# EAGLE board tr02 (EAGLE 6.6.0), part 1 of 2
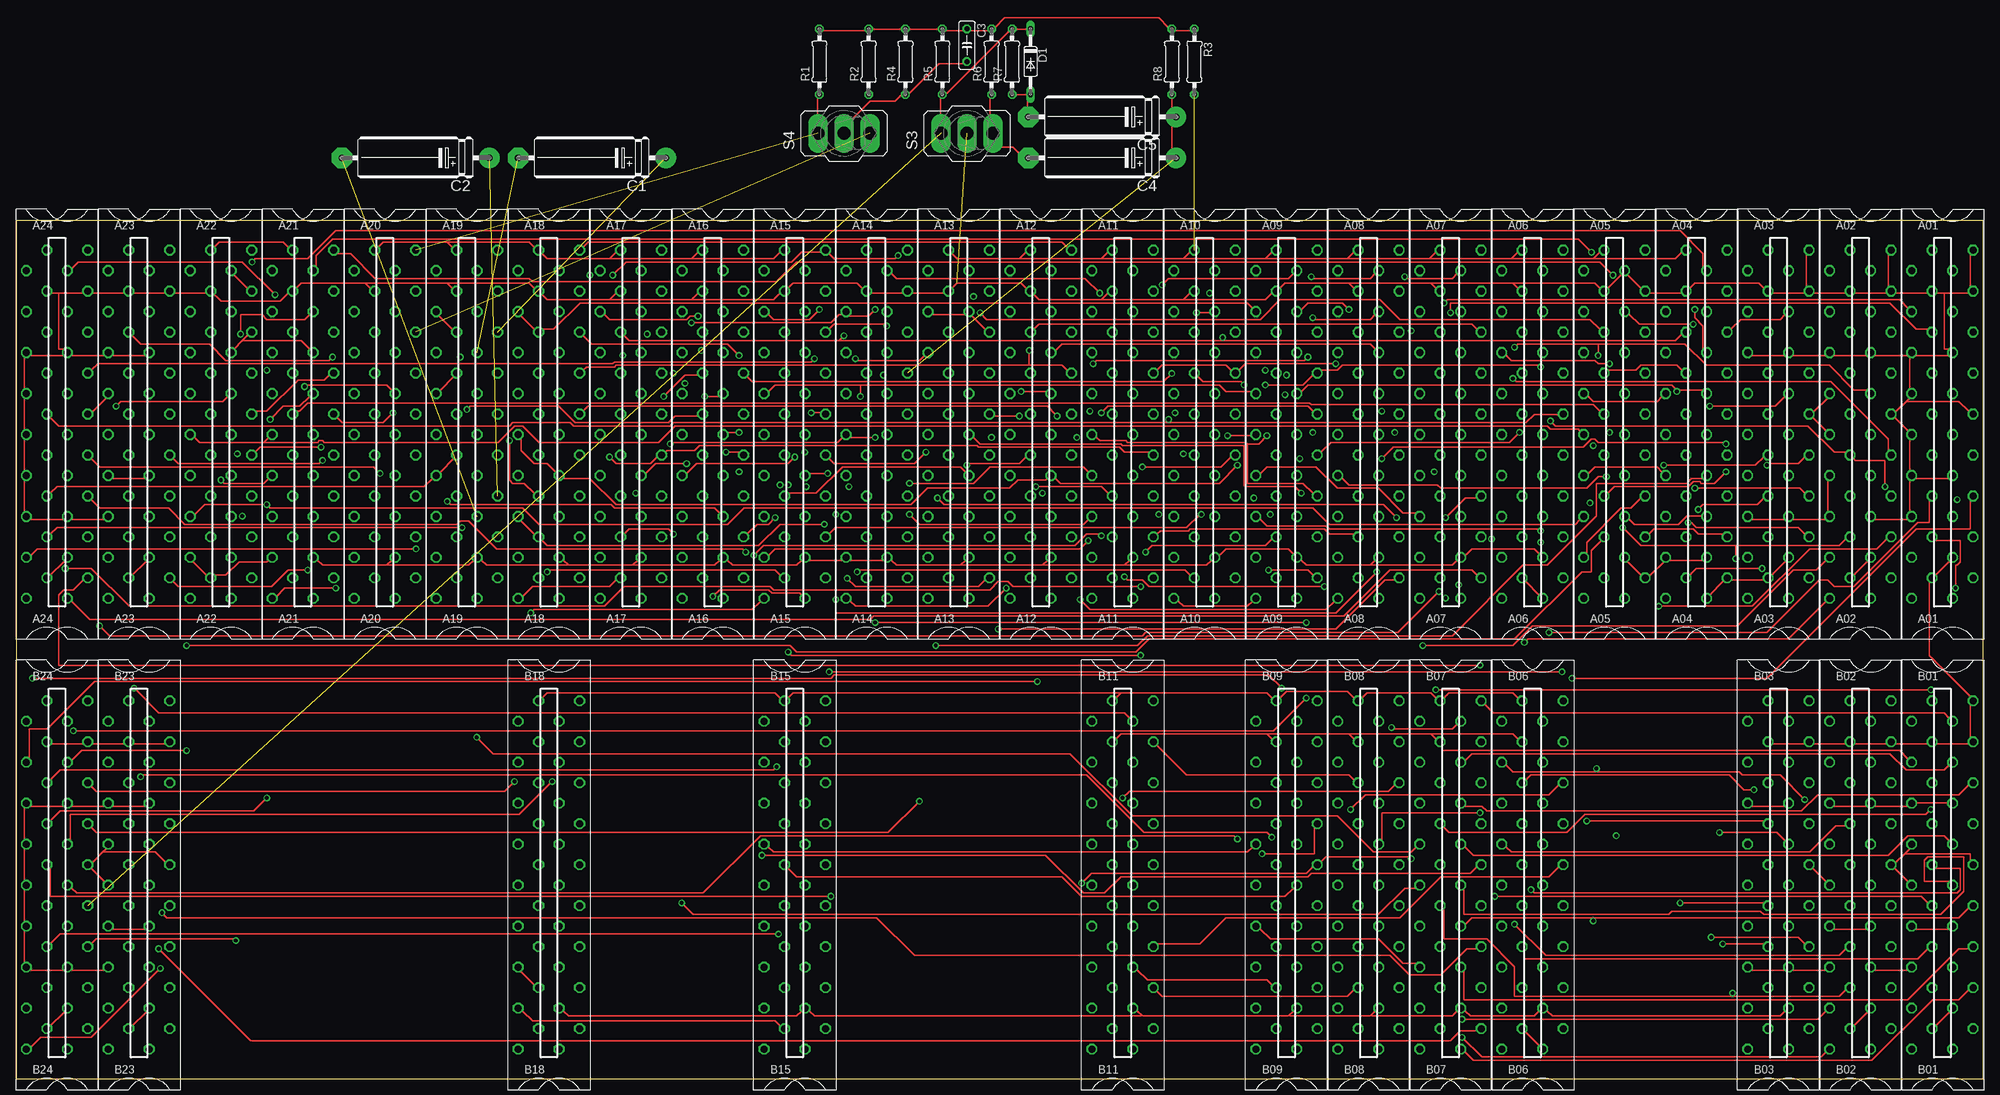
[diagram p10: board, top side]
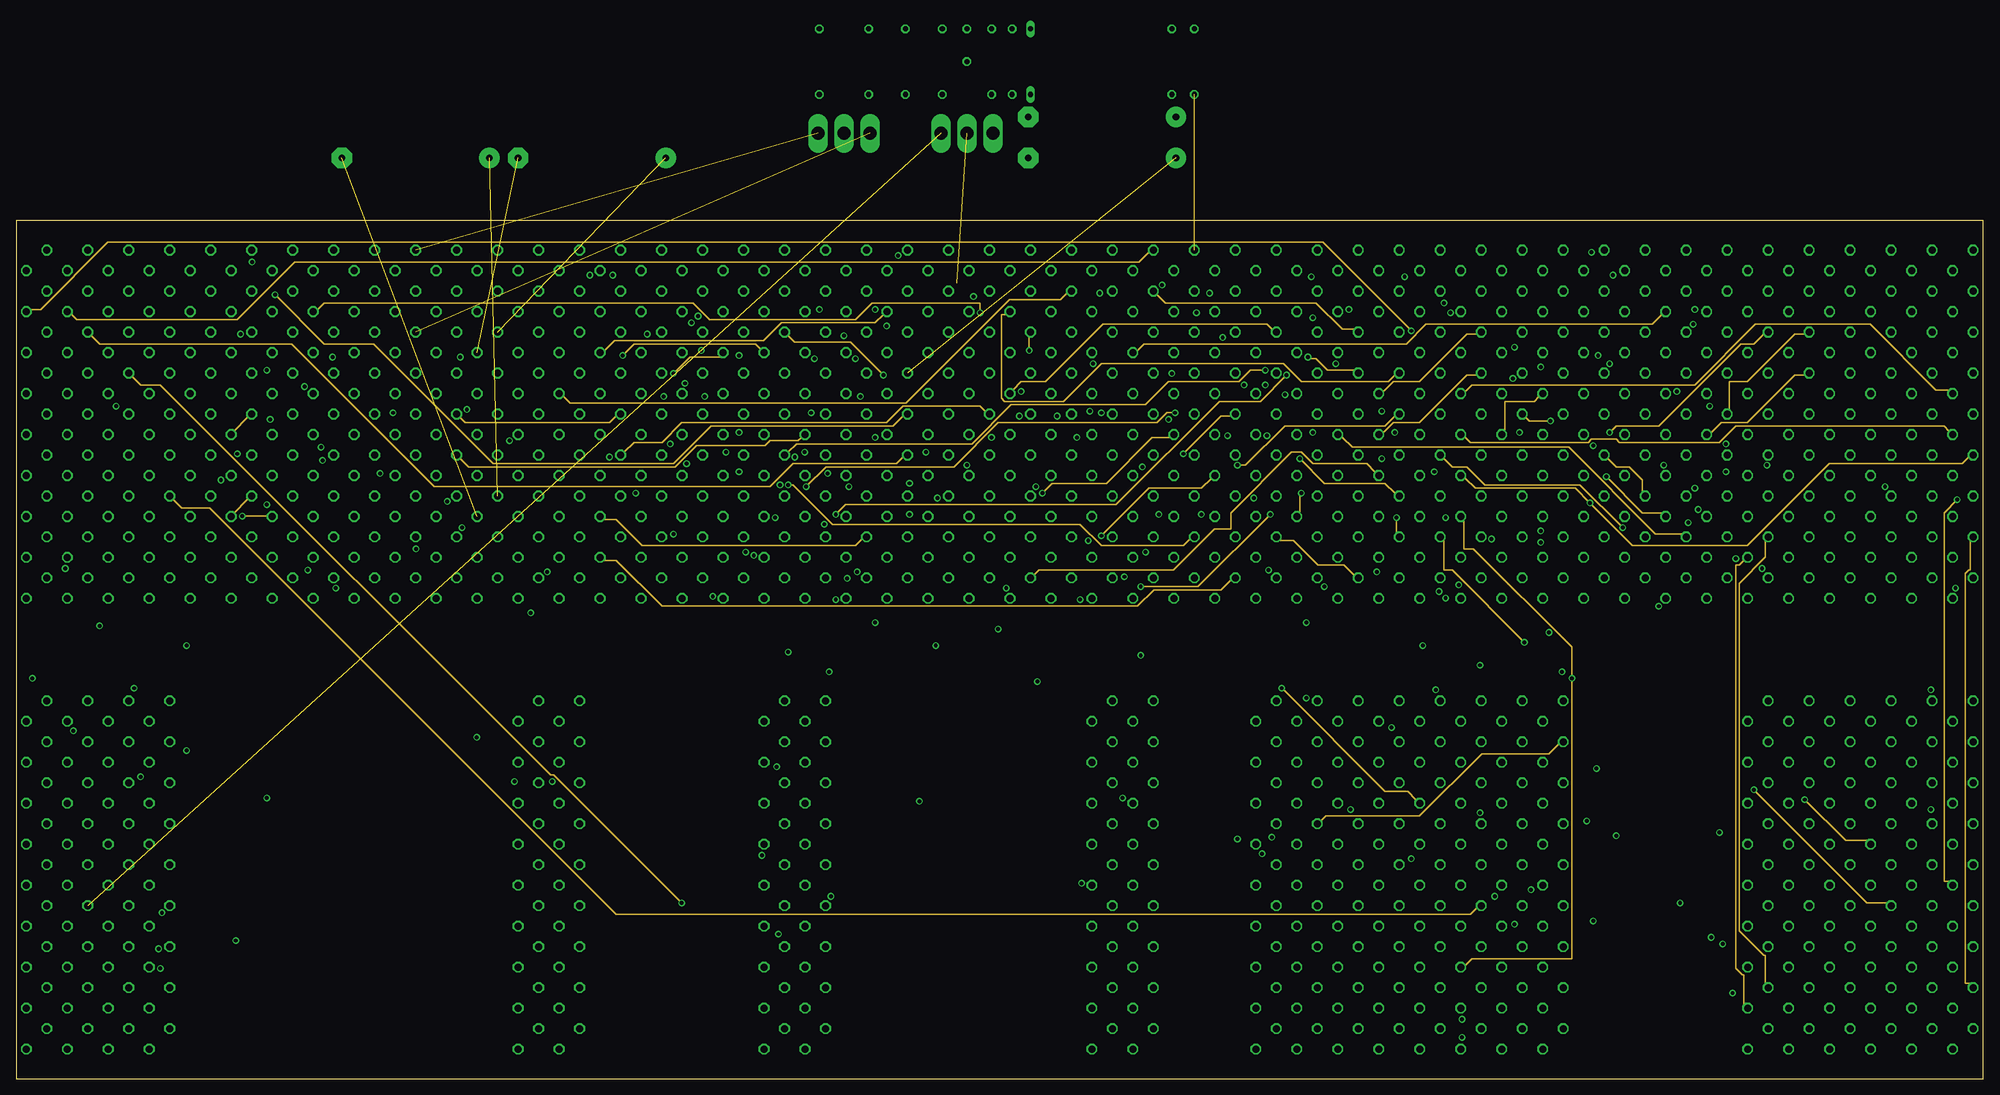
[diagram p11: board, inner layer Route2]
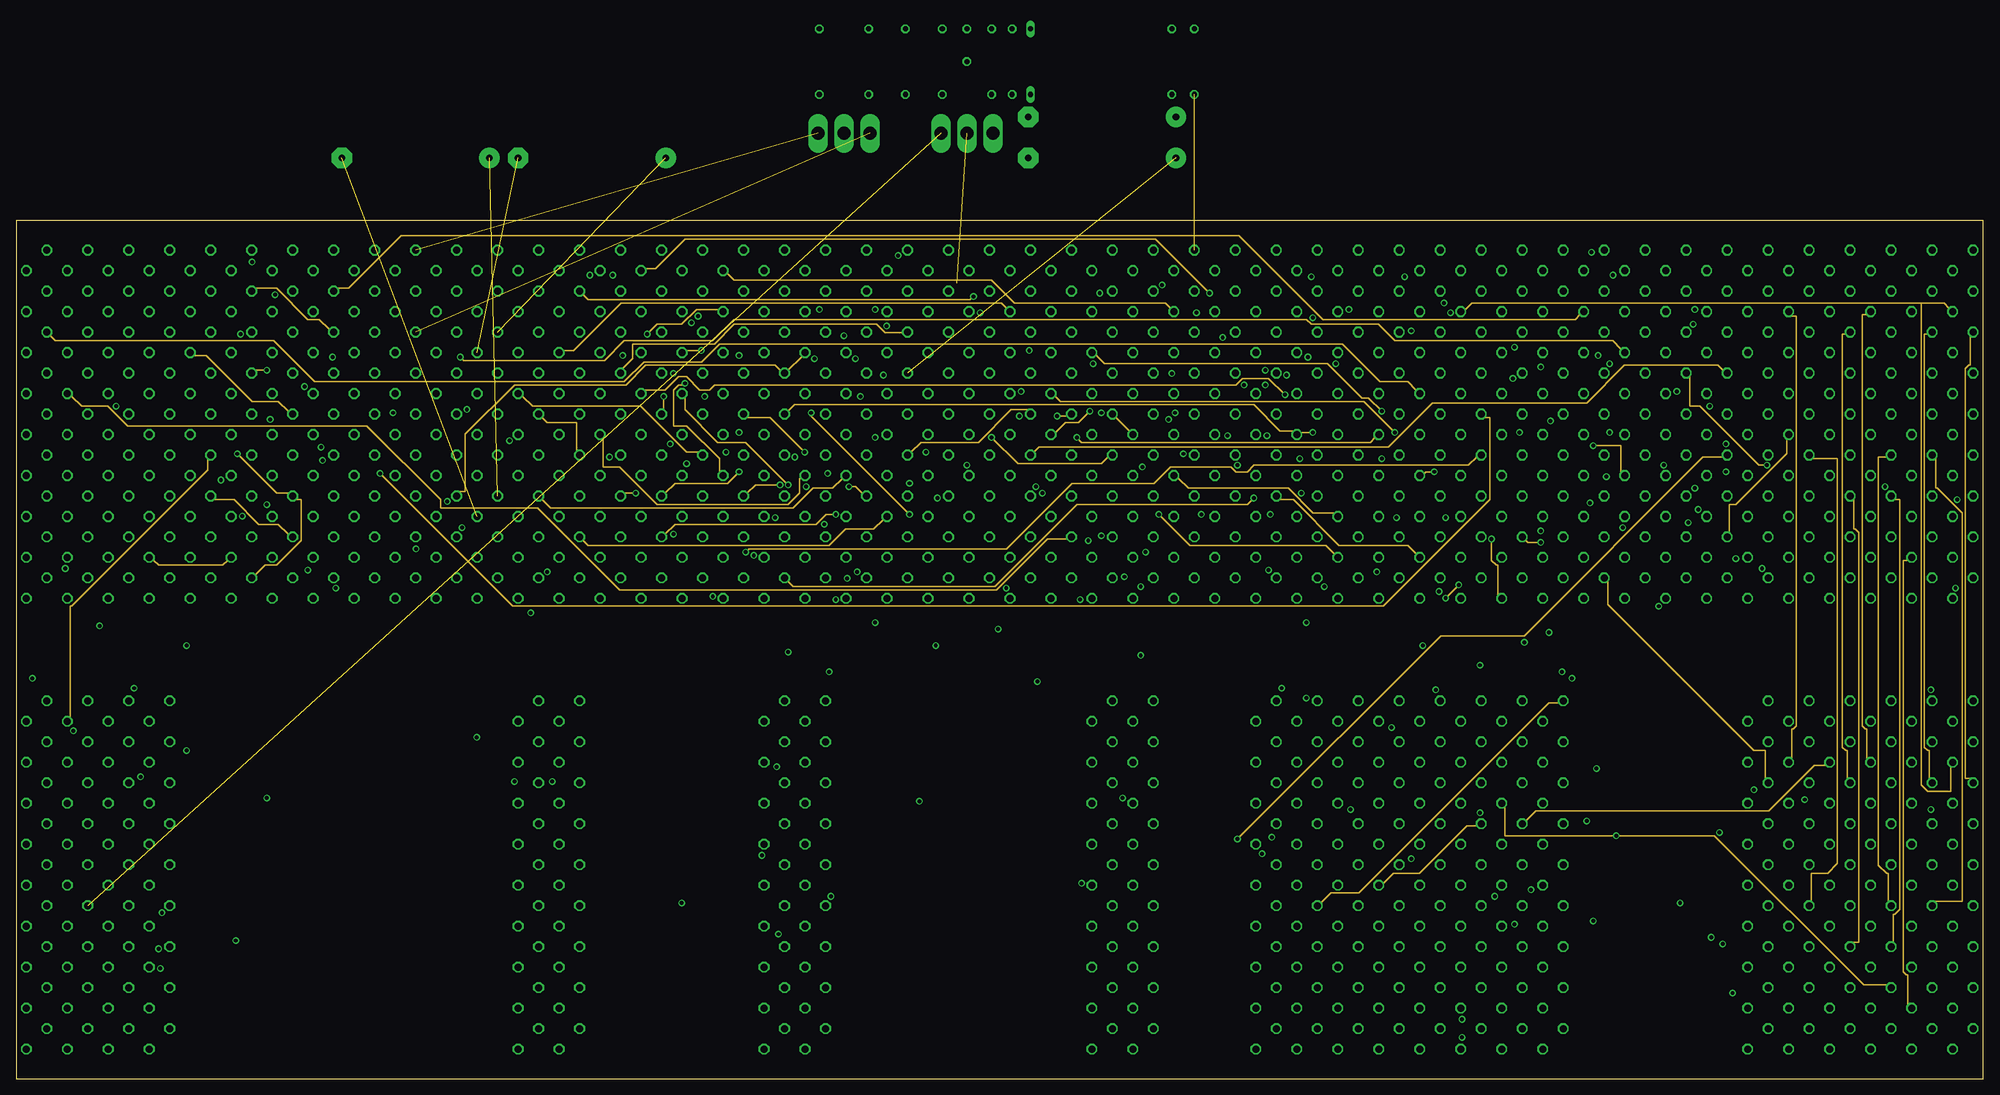
[diagram p12: board, inner layer Route15]
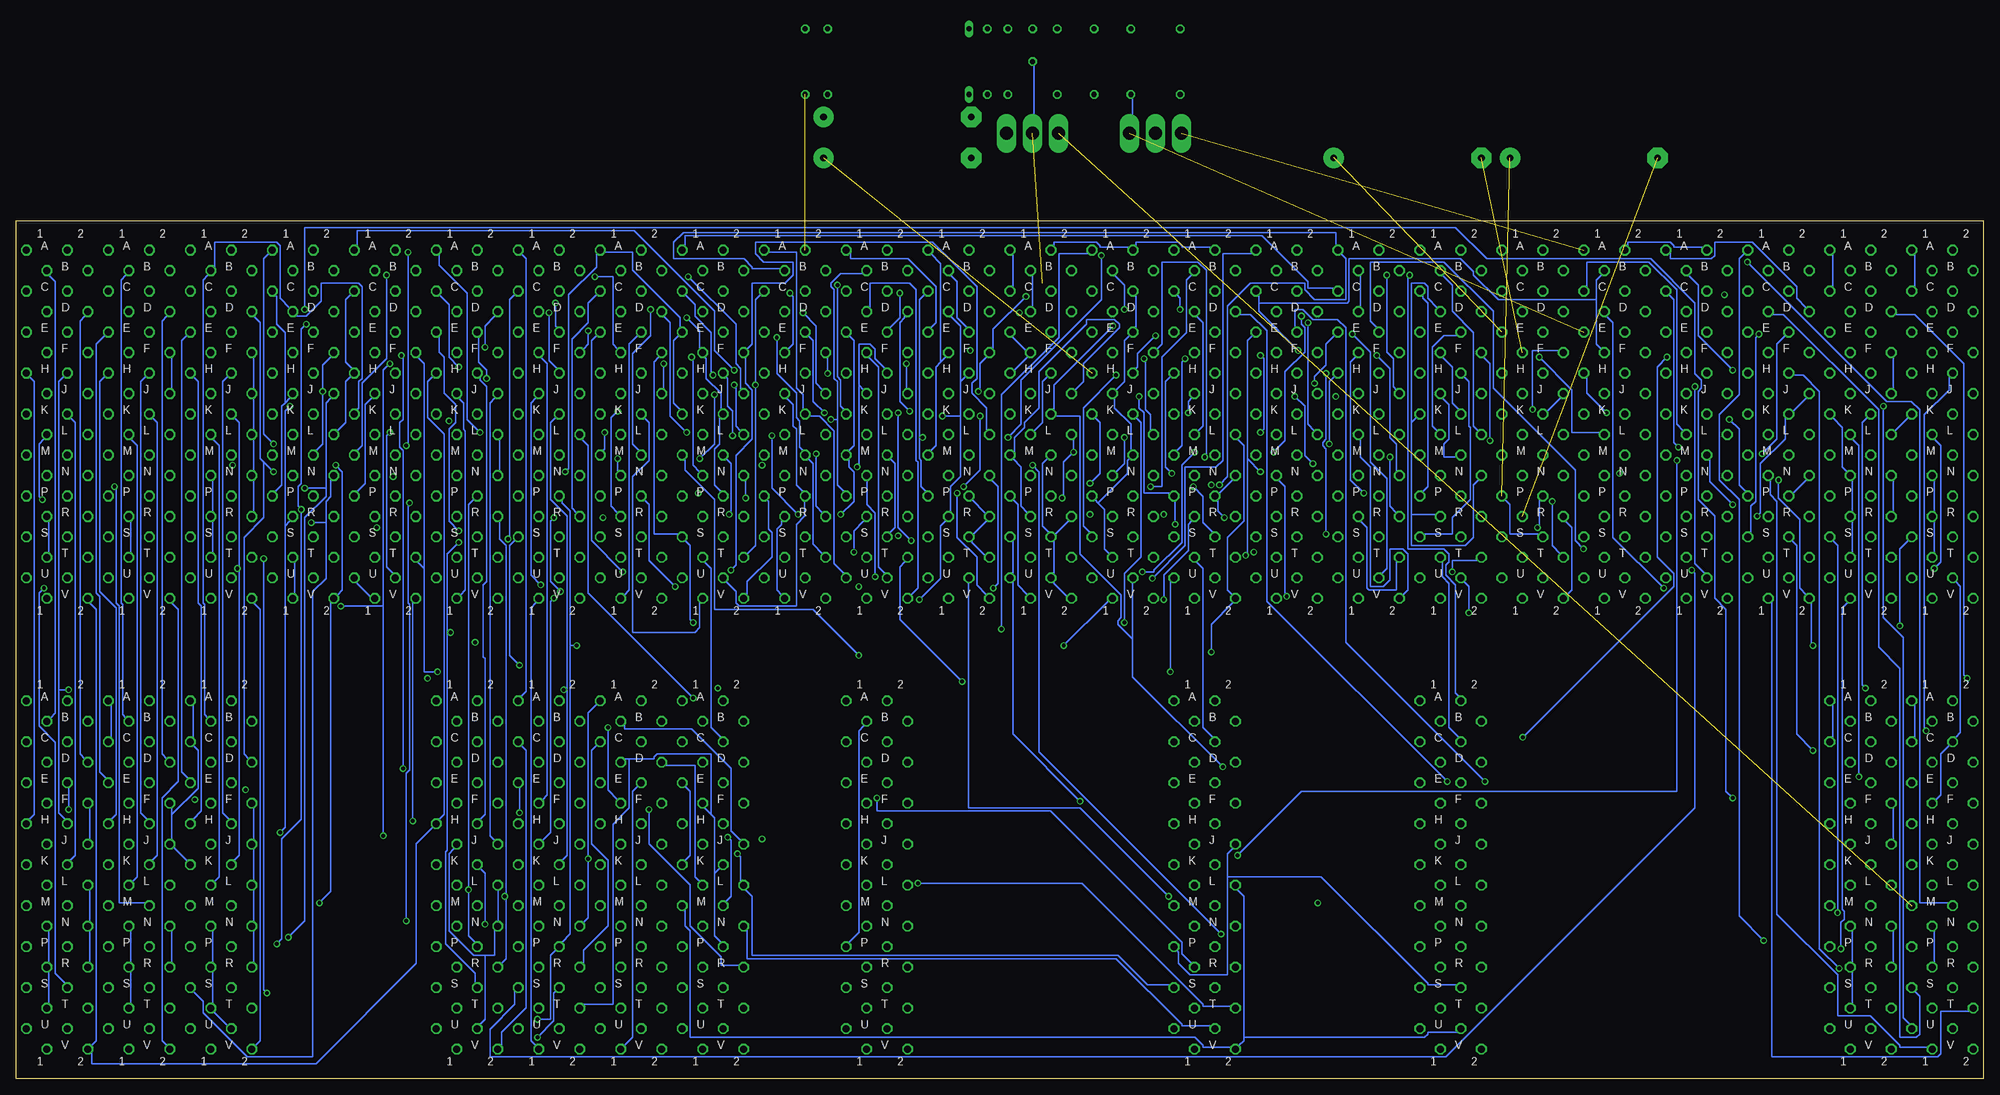
[diagram p13: board, bottom side, seen from below]

Size 304.78 x 133.02 mm. Coordinates in mm from the lower left corner, seen from the top.
Outline: 304.78,133.02 0,133.02 0,0 304.78,0 304.78,133.02
Copper layers (1*2*15*16): Top 0.035mm / dielectric 1.5mm / Route2 0.035mm / dielectric 0.15mm / Route15 0.035mm / dielectric 0.2mm / Bottom 0.035mm
Design rules "10mils": minimum track width 10mil, minimum drill 24mil, track to track 10mil, track to pad 10mil, pad to pad 10mil, via to via 10mil, smd to smd 10mil, copper to edge 25mil, drill to drill 10mil, minimum pad ring 10mil, minimum via ring 8mil, stop-mask expansion 0mil, vias tented up to drill 0mil, thermal gap 10mil
Net classes: 1 supply: width 0.203 mm

## Footprints (pad centres in the part's own frame; a part is rotated, then mirrored left to right if it is on the bottom)
H807 = drill 1.092 octagon: A1 4.763,28.575; A2 -1.587,28.575; B1 1.587,25.4; B2 -4.763,25.4; C1 4.763,22.225; C2 -1.587,22.225; D1 1.587,19.05; D2 -4.763,19.05; E1 4.763,15.875; E2 -1.587,15.875; F1 1.587,12.7; F2 -4.763,12.7; H1 4.763,9.525; H2 -1.587,9.525; J1 1.587,6.35; J2 -4.763,6.35; K1 4.763,3.175; K2 -1.587,3.175; L1 1.587,0; L2 -4.763,0; M1 4.763,-3.175; M2 -1.587,-3.175; N1 1.587,-6.35; N2 -4.763,-6.35; P1 4.763,-9.525; P2 -1.587,-9.525; R1 1.587,-12.7; R2 -4.763,-12.7; S1 4.763,-15.875; S2 -1.587,-15.875; T1 1.587,-19.05; T2 -4.763,-19.05; U1 4.763,-22.225; U2 -1.587,-22.225; V1 1.587,-25.4; V2 -4.763,-25.4
E22-6 = drill 1.016 pad 3.15: + -11.43,0 | drill 1.016 pad 3.15 octagon: - 11.43,0
C050-025X075 = drill 0.813 octagon: 1 -2.54,0; 2 2.54,0
DO35-10 = drill 0.813 long: A 5.08,0; C -5.08,0
0207/10 = drill 0.813 octagon: 1 -5.08,0; 2 5.08,0
320-916 = drill 2.007 long: 1 0,4.013; 2 0,0; 3 0,-4.013

## Placement (x,y rotation side)
A01  M903  [H807]  298.44,99.85 0 top
A02  M903  [H807]  285.74,99.85 0 top
A03  M903  [H807]  273.04,99.85 0 top
A04  M623  [H807]  260.34,99.85 0 top
A05  M623  [H807]  247.64,99.85 0 top
A06  M103  [H807]  234.94,99.85 0 top
A07  M101  [H807]  222.24,99.85 0 top
A08  M111  [H807]  209.54,99.85 0 top
A09  M115  [H807]  196.84,99.85 0 top
A10  M206X  [H807]  184.14,99.85 0 top
A11  M113  [H807]  171.44,99.85 0 top
A12  M117  [H807]  158.74,99.85 0 top
A13  M307  [H807]  146.04,99.85 0 top
A14  M206X  [H807]  133.34,99.85 0 top
A15  M115  [H807]  120.64,99.85 0 top
A16  M111  [H807]  107.94,99.85 0 top
A17  M113  [H807]  95.23,99.85 0 top
A18  M117  [H807]  82.53,99.85 0 top
A19  M302  [H807]  69.83,99.85 0 top
A20  M162  [H807]  57.13,99.85 0 top
A21  M162  [H807]  44.44,99.85 0 top
A22  M111  [H807]  31.73,99.85 0 top
A23  G784  [H807]  19.04,99.85 0 top
A24  G784  [H807]  6.33,99.85 0 top
B01  M903  [H807]  298.44,30 0 top
B02  M903  [H807]  285.74,30 0 top
B03  M903  [H807]  273.04,30 0 top
B06  M103  [H807]  234.94,30 0 top
B07  M101  [H807]  222.24,30 0 top
B08  M111  [H807]  209.54,30 0 top
B09  M115  [H807]  196.84,30 0 top
B11  M113  [H807]  171.44,30 0 top
B15  M115  [H807]  120.64,30 0 top
B18  M117  [H807]  82.53,30 0 top
B23  G784  [H807]  19.04,30 0 top
B24  G784  [H807]  6.33,30 0 top
C1  1uf  [E22-6]  89.2,142.71 180 top  (outside the outline)
C2  1uf  [E22-6]  61.9,142.71 180 top  (outside the outline)
C3  .01uf  [C050-025X075]  147.31,160.17 270 top  (outside the outline)
C4  1uf  [E22-6]  168.26,142.71 180 top  (outside the outline)
C5  1uf  [E22-6]  168.26,149.06 180 top  (outside the outline)
D1  D664  [DO35-10]  157.15,157.63 270 top  (outside the outline)
R1  10K  [0207/10]  124.44,157.63 90 top  (outside the outline)
R2  10K  [0207/10]  132.07,157.63 90 top  (outside the outline)
R3  330  [0207/10]  182.55,157.63 270 top  (outside the outline)
R4  750  [0207/10]  137.78,157.63 90 top  (outside the outline)
R5  10K  [0207/10]  143.5,157.63 90 top  (outside the outline)
R6  10K  [0207/10]  151.12,157.63 90 top  (outside the outline)
R7  10K  [0207/10]  154.29,157.63 90 top  (outside the outline)
R8  10K  [0207/10]  179.06,157.63 90 top  (outside the outline)
S3  [320-916]  147.31,146.52 90 top  (outside the outline)
S4  [320-916]  128.26,146.52 90 top  (outside the outline)

## Tracks (layer width: path | path; a pad name or v marks a point on that pad's centre or on a via)
0AC00H
  Route2 0.254: A08.H1 213.6,109.05 212.58,108.04 199.12,108.04 196.33,110.83 168.13,110.83 162.29,104.99 153.15,104.99 152.64,105.5 152.64,118.45 153.4,118.45 A12.D2
  Route15 0.254: A18.K2 82.28,101.69 86.85,101.69 86.85,97.37 A18.M1 | A12.D2 152.64,120.23 93.71,120.23 86.34,112.86 84.82,112.86 A18.F1
  Bottom 0.254: A18.F1 83.8,111.85 82.28,110.32 82.28,104.74 81.27,103.72 A18.K2
0AC00L  (via drill 0.61)
  Top 0.254: A18.A1 87.87,128.87 88.63,129.63 162.04,129.63 162.8,128.87 A12.A1 | A08.F1 209.79,113.88 162.04,113.88 161.02,112.86 A12.F1 | v215.12,124.29 215.38,124.04 222.49,124.04 223.25,124.8 A07.B1
  Bottom 0.254: 161.53,111.09 162.29,110.32 162.29,98.13 163.05,97.37 A12.M1 | 161.53,111.09 160.77,111.85 A12.F1 | v215.12,124.29 212.33,124.29 212.33,113.88 211.57,113.12 A08.F1 | 161.53,111.09 161.53,126.33 163.05,127.85 A12.A1
0AC01H  (via drill 0.61)
  Top 0.254: A18.L2 78.22,99.15 78.22,97.37 80.25,95.34 82.28,95.34 A18.N1 84.82,93.05 88.89,93.05 92.95,88.99 138.67,88.99 141.21,91.53 153.91,91.53 155.18,92.8 159.5,92.8 159.75,93.05 A12.N1 161.02,93.05 161.78,92.29 186.42,92.29 v189.22,95.08
  Route2 0.254: v189.22,95.08 190.49,95.08 196.58,101.18 212.08,101.18 213.6,102.7 A08.K1
  Bottom 0.254: A18.B1 83.8,124.55 82.28,123.02 82.28,118.96 78.98,115.66 78.98,101.18 78.22,100.42 A18.L2
0AC01L  (via drill 0.61)
  Top 0.254: 156.96,110.58 162.04,110.58 162.8,109.82 A12.H1 | 156.96,110.58 92.95,110.58 92.69,110.32 88.38,110.32 87.87,109.82 A18.H1 | 156.96,110.58 v156.96,112.86 | A07.E1 226.3,116.17 225.54,116.93 158.48,116.93 157.72,116.17 A12.E2
  Route2 0.254: A08.J1 211.82,106.52 213.35,108.04 217.41,108.04 224.78,115.4 226.3,115.4 A07.E1 | v156.96,112.86 156.96,115.15 A12.E2
  Bottom 0.254: A12.E2 157.47,116.42 158.99,117.94 158.99,123.53 160.01,124.55 A12.B1
0AC02H  (via drill 0.61)
  Top 0.254: v155.69,106.52 159.75,106.52 A12.J1
  Route15 0.254: v213.6,100.16 208.77,104.99 161.78,104.99 161.02,105.75 A12.J1 | A18.C1 88.63,120.74 147.81,120.74 v148.32,121.25
  Bottom 0.254: A18.P1 86.85,91.02 86.09,91.78 86.09,120.23 86.85,120.99 86.85,121.5 A18.C1 | v155.69,106.52 155.43,106.77 155.43,110.83 154.42,111.85 A12.F2 153.4,113.12 153.4,116.17 v148.32,121.25 | v213.6,100.16 213.6,97.62 213.85,97.37 A08.M1
0AC02L  (via drill 0.61)
  Route2 0.254: A08.L1 211.82,100.16 213.35,101.69 217.41,101.69 224.78,109.05 226.3,109.05 A07.H1 | A18.J1 84.82,105.75 85.84,104.74 137.91,104.74 153.91,120.74 161.78,120.74 162.8,121.75 A12.C1
  Route15 0.254: v164.32,99.4 165.09,98.64 209.79,98.64 210.55,99.4 A08.L1
  Bottom 0.254: A18.M2 81.52,96.35 83.55,96.35 83.55,98.39 82.79,99.15 82.79,104.48 83.8,105.5 A18.J1 | 164.83,99.4 164.83,120.74 A12.C1 | 164.83,99.4 164.83,96.1 164.58,95.85 164.58,91.78 163.82,91.02 A12.P1 | 164.83,99.4 v164.32,99.4
0B01B_L  (via drill 0.61)
  Top 0.254: v36.56,126.58 37.07,127.09 45.2,127.09 49.52,131.41 257.8,131.41 261.35,127.85 261.35,125.82 A04.B1
  Bottom 0.254: v36.56,126.58 14.97,104.99 11.16,104.99 9.89,103.72 9.89,27.27 5.32,27.27 B24.M2
0BOT_FF_H  (via drill 0.61)
  Top 0.254: v153.4,76.03 150.61,73.24 130.03,73.24 129.27,74 A14.V2
  Bottom 0.254: v153.4,76.03 152.64,76.8 152.64,91.78 153.66,92.8 A12.N2
0BOT_L  (via drill 0.61)
  Top 0.254: v117.84,48.35 117.33,47.84 6.84,47.84 5.32,46.32 B24.E2 | v134.86,116.67 134.61,116.93 126.73,116.93 125.97,116.17 A15.E1
  Bottom 0.254: v117.84,48.35 131.81,62.32 131.81,68.16 | 131.81,68.16 131.81,77.05 A14.U2 | 131.81,68.16 134.1,70.45 134.1,70.95 133.59,71.46 133.59,75.02 139.94,81.37 139.94,102.7 143.75,102.7 A13.K2 144,103.72 144,107.53 v134.86,116.67
0BOTFF_L  (via drill 0.61)
  Top 0.254: v142.48,67.14 173.72,67.14 175.25,68.67 222.49,68.67 233.41,79.59 237.22,79.59 244.84,87.21 244.84,92.29 258.81,92.29 259.57,93.05 261.35,93.05 A04.N1
  Bottom 0.254: v142.48,67.14 135.62,74 A14.V1
0DATA_BUSY_L  (via drill 0.61)
  Top 0.254: v83.04,46.06 77.96,40.98 8.37,40.98 8.37,36.92 B24.J1 | v124.44,119.21 122.92,117.69 117.33,117.69 116.57,118.45 A15.D2
  Bottom 0.254: v83.04,46.06 110.98,74 110.98,115.91 113.52,118.45 115.3,118.45 A15.D2 | v124.44,119.21 124.44,120.99 124.95,121.5 A15.C1
0DENSITY_SEL  (1 unrouted)
  Top 0.254: D1.C 156.7,162.65 154.93,162.65 R7.2 153.91,162.4 144.26,152.74 144,152.74 R5.1 143.24,151.98 143.24,149.44 S3.1
0DISABLE_MANCTL_L
  Route2 0.254: A24.E1 11.67,115.15 12.94,113.88 42.66,113.88 64.75,91.78 116.83,91.78 120.38,95.34 136.38,95.34 137.4,96.35 A14.M1
  Route15 0.254: A14.M1 138.67,97.12 140.19,98.64 149.08,98.64 154.16,103.72 156.7,103.72 A12.K2
0ENABLE_L  (1 unrouted)
  Top 0.254: R8.1 179.06,151.98 179.06,150.46 C5.+ 179.06,147.66 179.06,144.11 C4.+
0EOT_L  (via drill 0.61)
  Top 0.254: v158.23,61.56 12.18,61.56 4.81,54.19 2.02,54.19 2.02,49.62 B24.D2
  Bottom 0.254: v158.23,61.56 167.88,71.21 167.88,79.34 167.12,80.1 A11.T2
0EOTFF_L
  Route2 0.254: A04.D2 255,118.45 253.48,116.93 218.43,116.93 215.38,113.88 174.74,113.88 173.72,112.86 A11.F1
  Bottom 0.254: A11.U2 170.17,78.32 171.18,79.34 171.18,110.32 172.71,111.85 A11.F1
0FILE_PROT_L  (via drill 0.61)
  Top 0.254: v189.22,37.17 188.71,37.68 115.3,37.68 106.41,28.79 9.38,28.79 8.62,29.55 B24.L1
  Route15 0.254: v189.22,37.17 220.71,68.67 233.67,68.67 261.35,96.35 264.4,96.35 A04.M1
0FILEGAP_L
  Route15 0.254: A24.J1 8.62,105.75 10.14,104.23 14.21,104.23 17.26,101.18 54.34,101.18 65.77,89.75 65.77,88.48 80.76,88.48 93.46,75.78 151.88,75.78 159.75,83.65 162.8,83.65 A12.S1
0FWD_ENABLE  (via drill 0.61)
  Top 0.254: v92.44,124.55 94.47,126.58 120.13,126.58 121.65,128.11 124.7,128.11 A15.A1 125.97,127.85 126.73,127.09 136.13,127.09 v136.64,127.6
  Route15 0.254: v151.12,99.4 155.18,95.34 168.13,95.34 169.15,96.35 A11.M2
  Bottom 0.254: A11.S2 169.4,84.67 168.64,85.43 168.64,95.34 169.4,96.1 A11.M2 | v92.44,124.55 92.44,112.61 91.42,111.59 91.42,107.28 90.92,106.77 A17.J2 | v151.12,99.4 149.08,101.43 149.08,108.29 136.64,120.74 v136.64,127.6
0FWD_LD_L  (via drill 0.61)
  Top 0.254: v194.04,78.83 200.14,78.83 200.9,78.07 A09.U1
  Bottom 0.254: v194.04,78.83 193.28,79.59 193.28,96.61 190.74,99.15 190.74,106.77 191.76,107.78 191.76,111.85 A09.F2 191.5,113.12 190.74,113.88 190.74,123.28 185.66,123.28 184.39,124.55 184.39,126.58 188.96,126.58 190.23,127.85 190.23,129.63 162.8,129.63 155.94,122.77 155.94,108.55 156.7,107.78 156.7,106.26 154.42,103.97 154.42,100.42 A12.L2
0GAP_H  (via drill 0.61)
  Top 0.254: v101.33,98.39 101.58,98.64 127.24,98.64 128,99.4 A14.L2 129.27,99.4 v133.08,99.4 | v130.03,111.59 130.29,111.34 139.94,111.34 140.7,112.1 A13.F2
  Bottom 0.254: v101.33,98.39 101.33,108.04 100.57,108.8 A17.H1 | v133.08,99.4 133.08,95.34 134.35,94.07 A14.N1 | v130.03,111.59 129.78,111.34 129.78,103.72 129.02,102.96 129.02,100.42 A14.L2
0GAP_L  (via drill 0.61)
  Top 0.254: v199.12,90.77 198.11,91.78 190.49,91.78 190.23,92.04 190.23,98.13 171.44,98.13 171.18,98.39 149.34,98.39 148.32,99.4 A13.L1
  Route2 0.254: v199.12,90.77 198.87,90.77 198.87,87.72 A09.R1
  Bottom 0.254: A13.H2 145.02,108.8 145.78,108.04 145.78,101.69 147.05,100.42 A13.L1
0GAPSP_L  (via drill 0.61)
  Top 0.254: v104.63,117.18 126.22,117.18 127.49,118.45 128,118.45 A14.D2 129.02,118.2 132.07,118.2 v133.08,119.21 | v167.88,121.75 165.59,124.04 136.38,124.04 135.62,124.8 A14.B1
  Bottom 0.254: v104.63,117.18 104.63,101.43 103.62,100.42 A16.L2 | v133.08,119.21 133.08,123.02 134.61,124.55 A14.B1 | v167.88,121.75 167.88,117.94 169.4,116.42 A11.E2
0GIP_L  (via drill 0.61)
  Top 0.254: v118.09,22.44 6.84,22.44 5.32,20.92 B24.P2 | v147.31,95.08 147.56,95.34 155.43,95.34 156.45,96.35 A12.M2
  Route15 0.254: A04.H1 264.4,109.82 263.64,110.58 249.16,110.58 243.32,104.74 219.44,104.74 212.58,97.88 158.48,97.88 157.72,97.12 A12.M2
  Bottom 0.254: v118.09,22.44 146.29,50.63 146.29,94.07 v147.31,95.08
0INITA_L  (via drill 0.61)
  Top 0.254: v199.88,70.7 v133.08,70.7
  Bottom 0.254: A08.F2 205.22,111.85 205.98,111.09 205.98,84.42 202.17,84.42 A09.S1 201.15,83.4 200.39,82.64 200.39,71.21 v199.88,70.7 | v133.08,70.7 133.08,78.32 130.54,80.86 130.54,101.69 131.3,102.45 A14.K2
0INITB_L  (via drill 0.61)
  Top 0.254: v152.13,69.68 204.46,69.68 212.08,77.3 213.6,77.3 A08.U1
  Bottom 0.254: v152.13,69.68 152.13,106.01 143.24,114.9 143.24,127.85 138.67,127.85 A14.A1
0IOT01L  (via drill 0.61)
  Top 0.254: v107.94,74.77 108.95,75.78 116.57,75.78 117.08,75.27 121.4,75.27 121.65,75.02 A15.V1
  Route15 0.254: v103.62,107.78 103.36,107.53 102.6,107.53 101.84,106.77 101.84,101.18 103.87,101.18 108.95,96.1 108.95,94.07 A16.N1
  Bottom 0.254: v107.94,74.77 108.19,75.02 108.19,91.78 109.2,92.8 A16.N1 | v103.62,107.78 103.62,108.8 101.84,110.58 101.84,113.88 100.57,115.15 A17.E1
0IOT02L  (via drill 0.61)
  Top 0.254: 257.29,106.77 256.53,107.53 200.14,107.53 199.12,106.52 A09.J1 | 257.29,106.77 261.35,106.77 A04.J1 | 257.29,106.77 v257.29,106.52
  Bottom 0.254: A04.M2 258.3,97.37 257.29,98.39 v257.29,106.52 257.29,110.58 256.02,111.85 A04.F2 | 263.13,104.74 262.37,105.5 A04.J1 | 263.13,104.74 263.64,104.23 263.64,92.04 264.65,91.02 A04.P1 | 263.13,104.74 263.13,115.66 264.4,116.93 264.4,121.25 264.65,121.5 A04.C1
0IOT03_1L  (via drill 0.61)
  Top 0.254: v166.86,110.83 167.37,111.34 199.63,111.34 v200.14,111.85
  Route2 0.254: A08.H2 207.25,109.82 203.19,109.82 201.41,111.59 200.39,111.59 v200.14,111.85
  Bottom 0.254: v166.86,110.83 166.86,106.77 A11.J2 | v200.14,111.85 199.88,111.59 199.88,95.08 198.87,94.07 A09.N1
0IOT04L  (via drill 0.61)
  Top 0.254: v174.99,81.62 176.01,82.64 193.53,82.64 194.55,83.65 A09.S2
  Route2 0.254: A08.U2 207.25,78.07 205.73,79.59 201.66,79.59 197.85,83.4 195.82,83.4 A09.S2
  Bottom 0.254: v174.99,81.62 174.99,84.92 173.47,86.45 A11.R1
0IOT05_1L  (via drill 0.61)
  Top 0.254: A18.V2 78.47,74.77 80,76.29 91.93,76.29 92.95,77.3 A17.U2
  Route15 0.254: v97.78,115.4 99.3,116.93 103.11,116.93 105.39,119.21 108.95,119.21 A16.D1
  Bottom 0.254: v97.78,115.4 94.98,112.61 94.98,95.59 92.44,93.05 92.44,79.08 93.2,78.32 A17.U2
0IOT06_2L  (via drill 0.61)
  Top 0.254: v174.23,76.29 154.42,76.29 153.66,77.05 152.13,77.05 150.86,75.78 117.33,75.78 116.83,76.29 94.22,76.29 91.17,73.24 17.51,73.24 11.67,79.08 v7.61,79.08
  Route2 0.254: v194.3,87.46 183.12,76.29 v174.23,76.29
  Bottom 0.254: v194.3,87.46 194.04,87.72 194.04,95.34 194.8,96.1 A09.M2 | v7.61,79.08 6.59,80.1 6.59,98.13 7.61,99.15 A24.L1
0IOT07_1L  (via drill 0.61)
  Route2 0.254: v193.53,109.82 191.25,109.82 189.47,108.04 178.55,108.04 174.99,104.48 154.16,104.48 148.07,98.39 120.89,98.39 119.62,97.12 A15.M2
  Bottom 0.254: v193.53,109.82 196.58,112.86 196.58,118.96 209.03,131.41 251.95,131.41 251.95,129.12 A05.A1
0IOT07_2L  (via drill 0.61)
  Top 0.254: v239.51,63.08 v125.97,63.08 | A05.P1 251.7,90 250.18,88.48 248.65,88.48 243.32,83.15 243.32,81.37 A05.T2
  Route2 0.254: A05.M2 246.62,96.1 247.89,94.83 249.92,94.83 251.95,92.8 251.95,91.02 A05.P1
  Bottom 0.254: A05.J1 249.67,105.5 250.68,104.48 250.68,92.29 251.95,91.02 A05.P1 | v125.97,63.08 125.97,77.05 A15.U1 | v239.51,63.08 241.54,63.08 241.54,79.08 | 241.54,79.08 242.56,80.1 A05.T2 | 241.54,79.08 241.54,110.83 242.56,111.85 A05.F2
0IRG_H  (via drill 0.61)
  Route15 0.254: v211.57,103.47 209.54,105.5 208.52,105.5 203.19,110.83 168.64,110.83 167.37,112.1 A11.F2
  Bottom 0.254: v211.57,103.47 212.58,102.45 212.58,88.73 211.57,87.72 A08.R1
0IRG_L  (via drill 0.61)
  Top 0.254: v123.68,111.59 123.17,111.09 92.69,111.09 92.44,110.83 12.68,110.83 11.67,109.82 A24.H1 | v140.96,97.12 139.18,95.34 126.73,95.34 125.97,96.1 A15.M1 | v213.85,86.96 211.82,88.99 143.75,88.99 v142.73,90
  Route2 0.254: v213.85,86.96 213.85,84.67 A08.S1
  Bottom 0.254: v123.68,111.59 124.19,111.09 124.19,98.13 124.95,97.37 A15.M1 | A13.L2 140.96,99.15 v140.96,97.12 141.21,96.86 142.48,95.59 142.48,90.26 v142.73,90
0LD_FWD_L  (via drill 0.61)
  Top 0.254: v138.42,92.29 148.32,92.29 150.86,94.83 165.34,94.83 166.1,94.07 A11.N2 | v40.12,121.5 35.04,126.58 9.64,126.58 8.62,125.56 A24.B1
  Route2 0.254: v40.12,121.5 47.74,113.88 55.36,113.88 73.9,95.34 101.84,95.34 107.68,101.18 135.88,101.18 137.4,102.7 A14.K1
  Bottom 0.254: v138.42,92.29 136.89,93.81 136.89,101.69 137.65,102.45 A14.K1
0LPE_L  (via drill 0.61)
  Route15 0.254: v68.82,111.85 69.33,111.34 91.17,111.34 94.22,114.39 107.94,114.39 111.24,117.69 199.88,117.69 200.65,116.93 211.06,116.93 213.6,114.39 247.38,114.39 248.65,113.12 A05.F1
  Bottom 0.254: v68.82,111.85 63.74,106.77 63.74,100.16 59.42,100.16 A20.L1
0MB09H  (via drill 0.61)
  Top 0.254: A18.R2 78.22,86.45 80.25,84.42 A18.S2 82.28,82.64 115.05,82.64 118.35,85.94 v125.21,85.94 | 130.8,107.53 v130.8,105.75 | 130.8,107.53 117.59,107.53 116.57,106.52 A15.J2 | 130.8,107.53 186.42,107.53 187.44,106.52 191.5,106.52 A09.J2 | v200.65,124.29 200.9,124.04 209.79,124.04 210.55,124.8 A08.B1
  Bottom 0.254: v130.8,105.75 130.8,103.97 130.03,103.21 130.03,90.77 125.97,90.77 A15.P1 125.21,89.75 v125.21,85.94 | v200.65,124.29 193.28,116.93 193.28,110.83 192.52,110.07 192.52,106.77 A09.J2
0MB09L  (via drill 0.61)
  Top 0.254: v166.1,83.4 164.83,82.13 117.59,82.13 116.57,81.11 A15.T2 | v168.13,103.21 169.15,104.23 200.14,104.23 200.9,103.47 A09.K1
  Route15 0.254: v219.7,94.07 218.43,94.07 218.17,93.81 A07.N2
  Bottom 0.254: v166.1,83.4 168.13,85.43 v168.13,103.21 | A09.K1 201.92,103.72 202.93,104.74 202.93,114.39 A09.E1 201.92,116.42 201.92,117.94 209.28,125.31 209.28,128.11 213.6,128.11 A08.A1 214.87,127.85 214.87,125.82 219.19,121.5 219.19,94.58 v219.7,94.07
0MB10H  (via drill 0.61)
  Route15 0.254: v200.9,100.16 199.12,100.16 A09.L1 197.85,100.42 195.82,100.42 191.76,104.48 120.64,104.48 119.62,103.47 A15.K2
  Bottom 0.254: v200.9,100.16 203.44,102.7 203.44,117.18 204.46,118.2 A08.D2
0MB10L  (via drill 0.61)
  Top 0.254: v82.28,78.57 82.53,78.83 117.59,78.83 118.35,78.07 A15.U2 | A09.N2 192.77,93.81 193.79,94.83 201.41,94.83 204.71,91.53 211.06,91.53 214.87,87.72 216.9,87.72 A07.R2
  Route15 0.254: A15.U2 120.38,76.29 151.62,76.29 164.32,88.99 190.74,88.99 v191.76,90
  Bottom 0.254: v82.28,78.57 82.28,80.35 78.47,80.35 A18.T2 | A08.C1 216.14,120.23 216.14,117.18 218.68,114.64 218.68,88.48 217.92,87.72 A07.R2 | v191.76,90 191.76,92.8 A09.N2
0MB11H  (via drill 0.61)
  Top 0.254: v126.98,74.26 126.98,72.22 204.46,72.22 v210.81,78.57
  Bottom 0.254: v126.98,74.26 126.98,78.07 123.17,81.88 123.17,85.94 122.67,86.45 A15.R1 | v210.81,78.57 215.63,83.4 215.63,114.39 A08.E1
0MB11L  (via drill 0.61)
  Top 0.254: v200.9,117.94 201.15,117.69 209.79,117.69 210.55,118.45 A08.D1
  Route15 0.254: A07.T2 215.63,82.64 204.96,82.64 197.85,89.75 195.82,89.75 A09.P2
  Bottom 0.254: A09.P2 195.57,91.02 196.58,92.04 196.58,97.62 195.82,98.39 195.82,102.45 A09.K2 195.57,103.72 195.57,106.26 197.85,108.55 197.85,111.59 198.11,111.85 A09.F1 198.87,113.12 198.87,115.91 v200.9,117.94
0MYOP1  (via drill 0.61)
  Top 0.254: v79.74,72.22 80.25,72.73 114.03,72.73 115.3,74 A15.V2 | v232.9,100.16 231.38,98.64 203.69,98.64 202.17,97.12 A09.M1 | v119.62,66.13 120.13,65.62 v174.23,65.62
  Bottom 0.254: A15.L2 115.55,99.15 114.54,98.13 114.54,86.45 117.08,83.91 117.08,75.78 116.32,75.02 A15.V2 116.32,73.75 119.62,70.45 v119.62,66.13 | v79.74,72.22 79.74,76.29 80.5,77.05 A18.U2 | v232.9,100.16 234.94,102.2 234.94,121.75 239.25,126.07 239.25,127.85 A06.A1 | v174.23,65.62 181.34,72.73 196.58,72.73 196.58,89.75 201.15,94.32 201.15,96.1 A09.M1
0MYOP2  (via drill 0.61)
  Top 0.254: v183.63,87.46 183.37,87.46 181.34,85.43 126.98,85.43 125.97,84.42 A15.S1 | v187.69,99.66 191.5,99.66 A09.L2 | v193.53,107.53 199.38,107.53 200.9,109.05 A09.H1 202.17,109.82 204.71,109.82 205.47,110.58 235.95,110.58 v236.21,110.32
  Bottom 0.254: v183.63,87.46 187.69,91.53 v187.69,99.66 | v193.53,107.53 193.28,107.28 193.28,101.18 192.52,100.42 A09.L2 | v236.21,110.32 237.73,111.85 237.73,119.98 239.25,121.5 A06.C1
0MYOP4  (via drill 0.61)
  Top 0.254: v236.21,84.92 235.95,85.18 203.44,85.18 202.93,85.69 193.79,85.69 192.77,86.7 A09.R2
  Bottom 0.254: v236.21,84.92 237.73,86.45 237.73,100.67 236.71,101.69 236.71,104.48 238.49,106.26 238.49,111.85 239.25,112.61 239.25,115.15 A06.E1
0R_RESET_L  (via drill 0.61)
  Top 0.254: 178.04,101.69 101.84,101.69 101.33,101.18 86.34,101.18 85.84,101.69 76.95,101.69 76.44,101.18 6.59,101.18 5.32,102.45 A24.K2 | v178.55,102.2 178.04,101.69 | 178.04,101.69 233.92,101.69 235.19,102.96 239,102.96 A06.K1
  Bottom 0.254: 177.53,102.2 177.53,108.04 178.04,108.55 178.04,122.26 178.55,122.77 178.55,123.28 177.02,124.8 173.72,124.8 A11.B1 | 177.53,102.2 177.53,92.04 176.52,91.02 A11.P1 | 177.53,102.2 v178.55,102.2
0RD00H
  Top 0.254: A22.B1 33.77,124.55 35.8,122.52 A22.C1
  Route15 0.254: A21.E1 48.5,116.17 46.98,117.69 45.2,117.69 40.37,122.52 37.07,122.52 A22.C1
0RD00L  (via drill 0.61)
  Top 0.254: v247.38,124.55 245.35,126.58 120.89,126.58 117.84,123.53 80,123.53 79.49,124.04 55.61,124.04 51.8,127.85 49.77,127.85 A21.A1
  Bottom 0.254: v247.38,124.55 247.38,111.59 251.19,107.78 251.19,98.13 251.95,97.37 A05.M1 | A22.D2 27.42,119.47 28.94,120.99 28.94,122.77 35.8,129.63 41.64,129.63 41.64,127.6 42.15,127.09 48.5,127.09 48.5,128.11 A21.A1
0RD01H
  Top 0.254: 35.04,114.39 35.8,115.15 36.05,115.15 A22.E1 | 35.04,114.39 33.77,113.12 A22.F1 | A21.F1 44.18,114.39 35.04,114.39
0RD01L  (via drill 0.61)
  Top 0.254: v244.08,128.11 242.05,130.14 49.01,130.14 46.47,127.6 46.47,125.82 A21.B1
  Route15 0.254: v244.33,98.13 248.65,98.13 248.65,94.07 A05.N1 | v38.85,109.82 37.07,109.82 A22.H1
  Bottom 0.254: v244.33,98.13 244.08,98.39 v244.08,128.11 | v38.85,109.82 44.18,115.15 44.18,123.02 45.7,124.55 A21.B1
0RD02H
  Top 0.254: A21.H1 48.5,109.05 47.74,108.29 43.67,108.29 38.85,103.47 37.07,103.47 A22.K1
  Route2 0.254: A22.L1 33.77,100.42 35.8,102.45 36.05,102.45 A22.K1
0RD02L  (via drill 0.61)
  Top 0.254: v47.23,97.88 37.83,97.88 37.07,97.12 A22.M1
  Route15 0.254: A05.D2 242.3,118.45 241.54,117.69 202.42,117.69 189.47,130.65 59.67,130.65 51.55,122.52 49.77,122.52 A21.C1
  Bottom 0.254: v47.23,97.88 47.99,98.64 47.99,120.74 48.75,121.5 A21.C1
0RD03H  (via drill 0.61)
  Top 0.254: v39.35,102.2 41.39,104.23 43.93,104.23 45.45,105.75 A21.J1
  Route2 0.254: A22.R1 33.77,87.72 35.8,89.75 36.05,89.75 A22.P1
  Bottom 0.254: v39.35,102.2 37.83,100.67 37.83,92.04 36.81,91.02 A22.P1
0RD03L  (via drill 0.61)
  Top 0.254: v34.78,115.4 34.78,118.45 38.09,118.45 38.85,117.69 44.69,117.69 45.45,118.45 A21.D1 | v149.34,118.71 150.35,117.69 192.77,117.69 195.82,120.74 211.31,120.74 214.36,117.69 243.83,117.69 245.35,116.17 A05.E2
  Route2 0.254: v149.34,118.71 149.34,120.23 132.57,120.23 130.03,117.69 107.43,117.69 104.89,120.23 47.74,120.23 46.72,119.21 A21.D1
  Bottom 0.254: v34.78,115.4 35.29,114.9 35.29,89.5 36.05,88.73 36.05,84.67 A22.S1
0RD04H  (via drill 0.61)
  Route15 0.254: A22.U1 37.07,78.07 38.59,79.59 40.37,79.59 44.18,83.4 44.18,89.75 43.42,89.75 A21.P2 42.15,90.77 40.37,90.77 v34.27,96.86
  Bottom 0.254: A22.E2 31.99,113.88 31.99,99.15 v34.27,96.86
0RD04L
  Top 0.254: A05.K2 245.35,103.47 244.33,104.48 200.65,104.48 200.39,104.74 45.2,104.74 43.93,103.47 43.42,103.47 A21.K2
  Route15 0.254: A21.K2 42.15,103.47 40.62,104.99 36.56,104.99 29.45,112.1 27.67,112.1 A22.F2
0RD05H  (via drill 0.61)
  Route2 0.254: v35.04,87.21 39.1,87.21 A21.R2
  Bottom 0.254: v35.04,87.21 34.53,87.72 34.53,95.34 30.72,99.15 30.72,102.45 A22.K2 29.45,103.47 27.42,105.5 A22.J2
0RD05L
  Top 0.254: 38.34,98.64 28.43,98.64 27.67,99.4 A22.L2 | 38.34,98.64 39.1,99.4 A21.L2 | 38.34,98.64 46.72,98.64 46.98,98.89 47.48,98.89 47.74,98.64 74.66,98.64 77.2,101.18 78.47,101.18 81.01,98.64 99.55,98.64 102.09,101.18 237.22,101.18 237.73,100.67 242.05,100.67 242.3,100.42 A05.L2
0RD06H
  Route15 0.254: A21.S2 42.15,84.42 40.62,85.94 37.58,85.94 33.77,89.75 30.72,89.75 A22.P2
  Bottom 0.254: A22.N2 27.42,92.8 29.45,90.77 A22.P2
0RD06L  (via drill 0.61)
  Top 0.254: A22.R2 27.67,87.46 29.2,88.99 v38.85,88.99 39.1,88.73 39.35,88.48 78.47,88.48 81.01,85.94 110.22,85.94 112.76,88.48 200.9,88.48 203.44,85.94 241.54,85.94 242.3,86.7 A05.R2
  Bottom 0.254: v38.85,88.99 42.4,92.54 42.4,96.1 A21.M2
0RD07H
  Top 0.254: A22.T2 27.42,80.1 29.45,78.07 A22.U2 30.72,78.07 32.5,78.07 34.53,80.1 38.85,80.1 39.1,80.35 A21.T2
0RD07L  (via drill 0.61)
  Top 0.254: v31.73,92.8 32.24,92.29 38.34,92.29 39.1,93.05 A21.N2 | v26.4,67.14 119.87,67.14 120.89,66.13 173.47,66.13 175.5,68.16 232.14,68.16 242.56,78.57 244.08,78.57 244.08,81.88 245.6,83.4 A05.S2
  Bottom 0.254: v31.73,92.8 31.73,90 28.43,86.7 28.43,76.03 27.42,75.02 A22.V2 26.66,73.75 26.66,67.4 v26.4,67.14
0RD_DATA00L  (via drill 0.61)
  Top 0.254: v34.02,21.43 33.77,21.68 12.43,21.68 11.67,20.92 B24.P1
  Bottom 0.254: v34.02,21.43 37.83,25.23 37.83,89.75 40.88,92.8 40.88,102.96 37.83,106.01 37.83,127.09 A22.A1
0RD_DATA01L
  Bottom 0.254: B24.S1 10.65,13.55 9.89,12.79 9.89,6.95 10.4,6.44 12.94,6.44 12.94,63.59 16.24,66.89 16.24,103.72 30.97,118.45 32.75,118.45 A22.D1
0RD_DATA02L  (via drill 0.61)
  Top 0.254: v15.48,104.23 16.24,104.99 31.99,104.99 32.75,105.75 A22.J1
  Bottom 0.254: v15.48,104.23 15.48,71.46 12.43,68.41 12.43,9.49 11.41,8.47 B24.U1
0RD_DATA03L
  Bottom 0.254: B24.V1 8.62,4.92 12.94,4.92 12.94,5.17 17.51,9.74 22.59,9.74 22.59,16.09 31.99,25.49 31.99,89.5 33.01,90.51 33.01,92.8 A22.N1
0RD_DATA04L
  Bottom 0.254: B24.T2 2.27,10.5 6.59,10.5 6.59,3.9 7.1,3.39 32.75,3.39 32.75,74 A22.V1
0RD_DATA05L  (via drill 0.61)
  Top 0.254: v22.34,17.11 11.67,6.44 3.79,6.44 2.27,4.92 B24.V2
  Bottom 0.254: v22.34,17.11 25.38,20.16 25.38,106.52 27.93,109.05 29.45,109.05 A22.H2
0RD_DATA06L
  Route15 0.254: B24.B1 8.37,55.97 8.37,73.24 8.62,73.24 29.7,94.32 29.7,96.1 A22.M2
0RD_DATA07L  (via drill 0.61)
  Top 0.254: v26.4,50.89 10.14,50.89 8.62,49.37 B24.D1
  Bottom 0.254: v26.4,50.89 28.94,53.43 28.94,82.64 29.7,83.4 A22.S2
0RD_ENABLE_L  (via drill 0.61)
  Route2 0.254: v122.41,91.78 125.46,94.83 145.27,94.83 152.13,101.69 176.77,101.69 178.29,103.21 v179.56,103.21
  Bottom 0.254: v122.41,91.78 120.89,90.26 120.89,86.19 119.36,84.67 A15.S2 | v179.56,103.21 181.34,104.99 181.34,114.39 182.1,115.15 A10.E2
0RD_FWD_L  (via drill 0.61)
  Top 0.254: v76.44,98.89 76.44,92.8 76.95,92.29 78.72,92.29 80.25,90.77 A18.P2
  Route15 0.254: A14.N2 128,93.05 126.48,91.53 123.43,91.53 120.38,88.48 82.79,88.48 81.52,89.75 A18.P2
  Bottom 0.254: v76.44,98.89 76.44,110.83 77.45,111.85 A18.F2
0RD_LD_L
  Top 0.254: A18.D2 78.22,118.2 80.25,116.17 A18.E2 81.52,116.17 83.3,116.17 87.36,120.23 190.74,120.23 191.5,119.47 A09.D2
  Bottom 0.254: A18.L1 84.57,100.42 85.33,101.18 85.33,113.37 83.55,115.15 81.52,115.15 A18.E2
0RD_P_H  (via drill 0.61)
  Route15 0.254: v106.16,112.86 103.87,112.86 A16.F2
  Bottom 0.254: 59.93,120.74 59.93,123.79 59.17,124.55 A20.B1 | 59.93,120.74 59.93,113.88 59.17,113.12 A20.F1 | v106.16,112.86 112.25,118.96 112.25,120.23 | 112.25,120.23 112.25,121.5 A16.C1 | 59.93,120.74 75.17,120.74 78.98,124.55 78.98,125.06 81.01,127.09 98.28,127.09 98.28,120.48 98.54,120.23 112.25,120.23
0RD_PARITY_L  (via drill 0.61)
  Top 0.254: B24.E1 12.43,44.54 75.68,44.54 v77.2,46.06
  Bottom 0.254: v77.2,46.06 98.79,67.65 98.79,116.42 100.06,117.69 103.87,117.69 105.39,119.21 106.67,119.21 106.67,116.42 A16.E2
0RD_REV_L
  Route15 0.254: A14.R1 134.35,86.7 132.83,85.18 128.51,85.18 125.97,82.64 88.63,82.64 87.87,83.4 A18.S1
  Bottom 0.254: A18.S1 86.6,84.42 82.28,84.42 82.28,86.96 79.49,89.75 79.49,100.93 79.74,101.18 79.74,108.04 80.5,108.8 A18.H2
0READ_WRITE_H  (via drill 0.61)
  Top 0.254: v61.96,82.13 3.29,82.13 2.27,81.11 A24.T2 | 127.49,114.39 v128.26,115.15 | 127.49,114.39 94.98,114.39 94.22,115.15 A17.E2 | 186.93,114.39 127.49,114.39 | 186.93,114.39 257.03,114.39 258.05,115.4 A04.E2 | v186.93,114.9 186.93,114.39
  Bottom 0.254: A10.T2 179.82,81.37 181.34,82.89 181.34,95.34 182.1,96.1 A10.M2 182.87,97.37 183.37,97.88 183.37,101.94 183.88,102.45 183.88,106.26 186.93,109.31 v186.93,114.9 | v61.96,82.13 63.23,83.4 63.23,94.32 75.93,107.02 75.93,118.96 83.55,126.58 94.98,126.58 94.98,117.44 93.97,116.42 A17.E2 | v128.26,115.15 131.05,112.36 131.05,110.32 131.3,110.07 A14.H2
0RESET_L  (via drill 0.61)
  Top 0.254: v91.93,96.35 92.95,95.34 98.28,95.34 99.3,96.35 A17.M1 100.57,97.12 100.82,97.37 105.14,97.37 105.9,98.13 148.83,98.13 149.08,97.88 170.93,97.88 171.69,97.12 175.5,97.12 A11.M1
  Route2 0.254: A14.S2 131.05,83.65 130.03,82.64 97.01,82.64 92.95,86.7 91.17,86.7 A17.R2
  Route15 0.254: v177.02,87.46 181.85,82.64 202.93,82.64 204.2,81.37 A08.T2
  Bottom 0.254: v91.93,96.35 91.93,88.73 90.92,87.72 A17.R2 | v177.02,87.46 174.99,89.5 174.99,94.07 175.75,94.83 175.75,96.1 A11.M1 175.75,97.37 174.99,98.13 174.99,114.39 175.75,115.15 A11.E1
0REV_ENABLE  (via drill 0.61)
  Route2 0.254: v93.97,112.1 95.74,113.88 114.54,113.88 115.3,113.12 A15.F2
  Bottom 0.254: v93.97,112.1 91.93,110.07 91.93,99.4 90.92,98.39 90.92,94.07 A17.N2
0REWIND_L
  Route2 0.254: A24.D1 8.62,118.45 9.38,117.69 34.27,117.69 43.16,126.58 173.98,126.58 175.5,128.11 A11.A1
  Bottom 0.254: A12.E1 163.05,116.42 162.29,117.18 162.29,122.77 166.61,127.09 175.5,127.09 175.5,128.11 A11.A1
0RWND_DONE_L
  Bottom 0.254: A12.T2 154.67,81.11 156.7,83.15 156.7,83.4 A12.S2 156.45,84.42 154.42,86.45 A12.R2 154.67,87.46 154.67,87.72 156.7,89.75 A12.P2
0STROBE_H
  Route15 0.254: A10.D2 178.8,119.47 178.04,120.23 154.67,120.23 151.12,123.79 111.24,123.79 110.22,124.8 A16.B1
0STROBE_L  (via drill 0.61)
  Top 0.254: v139.94,43.02 135.11,38.19 12.43,38.19 11.67,38.95 B24.H1 | v128.76,77.56 130.03,76.29 149.08,76.29 150.1,77.3 A13.U1
  Bottom 0.254: v139.94,43.02 150.35,53.43 150.35,77.05 A13.U1 150.35,78.32 150.35,83.4 A13.S1 | v128.76,77.56 123.68,82.64 123.68,94.83 118.86,94.83 117.84,95.85 117.84,127.85 113.27,127.85 A16.A1
00SYNC_FWD_H  (via drill 0.61)
  Route15 0.254: v129.02,91.78 130.03,91.78 131.05,90.77 A14.P2
  Bottom 0.254: v129.02,91.78 127.24,91.78 127.24,111.85 123.43,115.66 123.43,123.79 122.67,124.55 A15.B1
0SYNC_FWD_L
  Top 0.254: A24.P2 5.32,90.77 6.33,91.78 63.23,91.78 64.5,93.05 A19.N2 65.52,94.07 65.77,94.07 67.8,96.1 A19.M2
  Route2 0.254: A15.L1 121.65,99.4 121.14,98.89 116.83,98.89 116.06,98.13 105.39,98.13 102.09,94.83 70.09,94.83 68.82,96.1 A19.M2
  Bottom 0.254: A15.L1 121.65,100.42 120.89,101.18 120.89,117.18 121.91,118.2 A15.D1
00SYNC_REV_H  (via drill 0.61)
  Route2 0.254: v134.35,109.05 129.27,114.13 120.64,114.13 119.62,115.15 A15.E2
  Bottom 0.254: v134.35,109.05 139.43,103.97 139.43,85.69 138.42,84.67 A14.S1
0SYNC_REV_L  (via drill 0.61)
  Top 0.254: v69.07,85.43 6.33,85.43 5.32,84.42 A24.S2
  Route15 0.254: A15.F1 121.91,111.85 121.65,111.85 119.62,109.82 A15.H2 118.35,109.82 117.59,110.58 97.52,110.58 94.47,107.53 77.2,107.53 69.58,99.91 69.58,91.02 68.56,91.02 A19.P2
  Bottom 0.254: v69.07,85.43 68.82,85.69 68.82,89.75 A19.P2
0TM_L  (via drill 0.61)
  Top 0.254: v38.85,43.52 36.81,41.49 6.84,41.49 5.32,39.97 B24.H2 | v260.08,119.21 260.08,117.94 261.35,116.67 261.35,113.12 A04.F1
  Bottom 0.254: v38.85,43.52 39.86,44.54 39.86,72.73 41.64,74.51 41.64,87.21 44.18,89.75 44.18,106.52 43.67,107.02 43.67,108.29 44.69,109.31 44.69,120.23 51.55,127.09 76.95,127.09 81.77,131.92 260.08,131.92 v260.08,119.21
0TR_READY_H  (via drill 0.61)
  Route2 0.254: v198.87,96.1 202.68,92.29 212.08,92.29 213.6,90.77 A08.P1
  Route15 0.254: v196.58,106.01 194.04,108.55 189.98,108.55 188.96,107.53 108.19,107.53 107.43,106.77 105.9,106.77 103.87,108.8 102.6,108.8 100.57,106.77 97.27,106.77 A17.J1
  Bottom 0.254: v198.87,96.1 196.58,98.39 v196.58,106.01
0TR_READY_L  (via drill 0.61)
  Top 0.254: v126.22,28.28 5.32,28.28 5.32,32.6 B24.K2 | v264.91,98.39 264.65,98.64 245.1,98.64 244.59,99.15 244.08,99.15 242.81,97.88 213.35,97.88 v211.57,96.1
  Route2 0.254: A08.N1 210.55,94.07 209.28,95.34 200.9,95.34 199.12,97.12 197.6,97.12 188.2,87.72 188.2,85.18 185.66,85.18 179.31,78.83 158.48,78.83 157.72,78.07 A12.U2
  Bottom 0.254: v126.22,28.28 139.94,42 157.21,42 157.21,77.05 A12.U2 | v264.91,98.39 266.43,99.91 266.43,127.09 265.67,127.85 A04.A1 | v211.57,96.1 211.57,94.07 A08.N1
0WDATA00L  (via drill 0.61)
  Top 0.254: v56.37,93.81 55.36,94.83 12.94,94.83 11.67,96.1 A24.M1
  Route15 0.254: v56.37,93.81 76.95,73.24 211.82,73.24 228.33,89.75 228.33,102.45 227.57,102.45 A07.K1
0WDATA01L  (via drill 0.61)
  Top 0.254: v113.02,81.62 112.51,82.13 74.41,82.13 70.09,86.45 68.82,86.45 68.31,85.94 26.15,85.94 23.61,88.48 12.94,88.48 11.67,89.75 A24.P1
  Route15 0.254: v113.02,81.62 113.52,82.13 153.4,82.13 163.56,92.29 176.26,92.29 178.8,94.83 188.2,94.83 188.96,94.07 190.74,94.07 191.76,95.08 225.03,95.08 226.3,96.35 A07.M1
0WDATA02L  (via drill 0.61)
  Top 0.254: v12.94,70.19 14.46,68.67 174.48,68.67 174.99,69.18 214.11,69.18 v220.46,75.53 | v221.47,86.96 224.52,90 226.3,90 A07.P1
  Bottom 0.254: v12.94,70.19 12.94,82.13 11.67,83.4 A24.S1 | v220.46,75.53 221.98,77.05 221.98,86.45 v221.47,86.96
0WDATA03L  (via drill 0.61)
  Top 0.254: v226.81,64.1 6.59,64.1 6.59,75.02 7.35,75.78 8.88,75.78 10.4,77.3 A24.U1
  Bottom 0.254: v226.81,64.1 228.33,65.62 228.33,82.64 227.57,83.4 A07.S1
0WDATA04L
  Top 0.254: A24.V1 8.62,74 11.41,71.21 132.32,71.21 132.83,71.72 205.73,71.72 212.84,78.83 225.54,78.83 226.3,78.07 A07.U1
0WDATA05L  (via drill 0.61)
  Route2 0.254: v216.14,115.91 202.42,129.63 14.21,129.63 3.79,119.21 2.27,119.21 A24.D2
  Bottom 0.254: v216.14,115.91 216.14,113.88 216.9,113.12 A07.F2
0WDATA06L
  Route15 0.254: A07.J2 216.9,106.77 215.63,108.04 211.31,108.04 205.47,113.88 108.95,113.88 106.16,111.09 97.27,111.09 94.22,108.04 46.21,108.04 39.86,114.39 6.08,114.39 5.32,115.15 A24.E2
0WDATA07L  (via drill 0.61)
  Top 0.254: v199.88,59.02 194.8,53.94 v8.88,53.94
  Bottom 0.254: v199.88,59.02 216.14,75.27 216.14,98.13 217.16,99.15 A07.L2 | v8.88,53.94 9.13,54.19 9.13,102.96 5.32,106.77 5.32,108.8 A24.H2
0WR_LD_L
  Route2 0.254: A12.J2 154.42,106.77 155.69,108.04 159.5,108.04 168.39,116.93 193.79,116.93 194.55,116.17 A09.E2
0WR_SET_H
  Route15 0.254: A17.H2 93.97,110.07 95.49,111.59 95.49,113.88 108.19,113.88 111.24,116.93 133.34,116.93 134.61,115.66 137.4,115.66 A14.E1
1AC00L  (via drill 0.61)
  Top 0.254: v213.09,54.45 213.35,54.19 222.49,54.19 223.25,54.95 B07.B1
  Bottom 0.254: v213.09,54.45 213.09,44.79 211.57,43.27 B08.F1
1AC01L  (via drill 0.61)
  Top 0.254: v226.81,41.24 211.57,41.24 211.57,36.92 B08.J1
  Bottom 0.254: v226.81,41.24 226.81,45.3 B07.E1
1AC02L
  Route15 0.254: B08.L1 211.82,30.32 213.35,31.84 217.41,31.84 224.78,39.2 226.3,39.2 B07.H1
1IOT04L
  Top 0.254: B11.R1 173.72,16.85 175.25,15.33 193.79,15.33 194.55,14.57 B09.S2
1IOT06_2L  (via drill 0.61)
  Top 0.254: v19.29,46.83 19.54,47.08 165.85,47.08 174.74,38.19 193.79,38.19 v194.55,37.43
  Bottom 0.254: v19.29,46.83 19.29,98.13 20.3,99.15 A23.L1 | v194.55,37.43 194.04,36.92 194.04,28.28 194.8,27.52 B09.M2
1MB09H
  Top 0.254: B18.R2 78.22,16.6 80.25,14.57 B18.S2 | B09.J2 191.5,35.9 190.74,35.14 117.33,35.14 116.57,35.9 B15.J2
  Bottom 0.254: B09.J2 192.52,36.92 194.04,38.44 194.04,48.09 200.14,54.19 210.55,54.19 210.55,54.95 B08.B1 | 117.08,31.33 117.08,34.89 116.32,35.65 B15.J2 | 117.08,31.33 117.08,16.09 122.92,16.09 124.7,17.87 124.7,19.65 124.95,19.9 B15.P1 | 117.08,31.33 102.6,31.33 86.09,14.82 86.09,14.57 81.52,14.57 B18.S2
1MB09L  (via drill 0.61)
  Top 0.254: v165.09,30.32 166.61,31.84 199.88,31.84 200.9,32.86 B09.K1 202.17,33.62 202.93,34.38 215.89,34.38 v216.14,34.12
  Bottom 0.254: B08.A1 216.14,56.73 v216.14,34.12 216.14,24.98 B07.N2 | v165.09,30.32 139.69,30.32 120.89,11.52 120.89,11.27 116.57,11.27 B15.T2 | B09.E1 201.15,45.3 200.39,44.54 200.39,34.63 201.15,33.87 B09.K1
1MB10H
  Top 0.254: B15.K2 119.62,32.6 120.89,31.33 162.04,31.33 165.09,28.28 196.58,28.28 197.85,29.55 B09.L1
  Bottom 0.254: B08.D2 204.2,48.6 199.63,48.6 199.63,31.33 198.87,30.57 B09.L1
1MB10L
  Top 0.254: B18.T2 78.47,10.5 80,8.98 117.59,8.98 118.35,8.22 B15.U2 | B09.N2 192.77,23.2 194.3,21.68 211.06,21.68 214.87,17.87 216.9,17.87 B07.R2
  Bottom 0.254: B08.C1 214.87,51.65 215.63,50.89 215.63,36.41 213.09,33.87 213.09,23.71 216.9,19.9 216.9,17.87 B07.R2 | B15.U2 119.62,8.22 124.19,8.22 124.19,8.47 134.35,18.63 191.5,18.63 191.5,23.2 B09.N2
1MB11H  (via drill 0.61)
  Top 0.254: v171.44,43.52 172.45,44.54 212.58,44.54 213.6,45.55 B08.E1
  Bottom 0.254: v171.44,43.52 171.44,41.49 144.51,41.49 124.19,21.17 124.19,19.39 122.67,17.87 B15.R1
1MB11L
  Bottom 0.254: 196.58,31.84 196.58,22.19 195.57,21.17 B09.P2 | 196.58,31.84 195.82,32.6 B09.K2 | 197.09,40.98 196.58,40.48 196.58,31.84 | 197.09,40.98 198.11,42 B09.F1 | 209.79,49.62 205.98,49.62 205.98,49.87 205.47,50.38 197.09,50.38 197.09,40.98 | 209.79,49.62 210.55,49.62 B08.D1 | 209.79,49.62 209.79,42 212.33,39.46 212.33,11.52 216.9,11.52 B07.T2
1MYOP1
  Route15 0.254: B09.M1 202.17,27.27 203.69,28.79 208.01,28.79 237.48,58.26 239,58.26 B06.A1
  Bottom 0.254: 114.54,6.44 114.54,28.28 115.55,29.3 B15.L2 | 114.54,6.44 114.54,5.93 115.3,5.17 B15.V2 116.57,4.92 120.89,4.92 120.89,5.17 122.16,6.44 200.39,6.44 200.39,22.95 201.15,23.71 201.15,26.25 B09.M1 | 114.54,6.44 86.6,6.44 86.09,6.95 86.09,7.2 81.52,7.2 B18.U2
1MYOP2  (via drill 0.61)
  Top 0.254: v193.03,34.89 201.15,34.89 201.15,38.95 B09.H1
  Route2 0.254: B06.C1 239,51.91 237.48,50.38 227.06,50.38 217.41,40.73 202.93,40.73 202.17,39.97 B09.H1
  Bottom 0.254: B15.S1 125.97,14.57 129.53,14.57 134.1,19.14 190.74,19.14 190.74,28.28 191.76,29.3 B09.L2 192.52,30.57 192.52,34.38 v193.03,34.89
1MYOP4  (via drill 0.61)
  Top 0.254: v206.74,41.74 209.03,44.03 237.48,44.03 239,45.55 B06.E1
  Bottom 0.254: v206.74,41.74 206.74,36.41 200.39,30.06 200.39,23.71 195.57,18.89 195.57,17.62 192.77,17.62 B09.R2
1R_RESET_L  (via drill 0.61)
  Top 0.254: B06.K1 239,32.86 237.48,31.33 220.71,31.33 214.36,24.98 187.44,24.98 183.37,20.92 176.77,20.92 B11.P1 | v18.27,60.54 22.08,56.73 171.69,56.73 172.45,55.97 B11.B1
  Bottom 0.254: B11.P1 175.75,21.17 174.23,22.7 174.23,53.94 173.47,54.7 B11.B1 | v18.27,60.54 18.78,61.05 18.78,101.69 18.02,102.45 A23.K2
1WDATA00L  (via drill 0.61)
  Top 0.254: v115.55,34.63 159.5,34.63 165.34,28.79 168.64,28.79 171.18,31.33 200.14,31.33 200.65,31.84 225.28,31.84 226.3,32.86 B07.K1 | v47.48,95.85 46.98,95.34 25.13,95.34 24.37,96.1 A23.M1
  Bottom 0.254: v115.55,34.63 105.65,44.54 47.48,44.54 v47.48,95.85
1WDATA01L
  Route2 0.254: A23.P1 24.37,89.75 25.64,88.48 29.96,88.48 92.95,25.49 225.28,25.49 226.3,26.51 B07.M1
1WDATA02L  (via drill 0.61)
  Top 0.254: v22.59,25.74 23.35,24.98 133.34,24.98 139.18,19.14 212.84,19.14 215.89,16.09 220.71,16.09 224.78,20.16 226.3,20.16 B07.P1
  Bottom 0.254: v22.59,25.74 22.59,82.64 23.35,83.4 A23.S1
1WDATA03L  (via drill 0.61)
  Top 0.254: v45.2,78.83 42.15,78.83 39.61,76.29 25.13,76.29 24.37,77.05 A23.U1
  Bottom 0.254: v45.2,78.83 44.69,78.32 44.69,42 83.3,3.39 231.38,3.39 231.38,7.71 227.57,11.52 227.57,13.55 B07.S1
1WDATA04L  (via drill 0.61)
  Top 0.254: v22.08,20.16 36.31,5.93 222.24,5.93 223.76,7.46 226.3,7.46 B07.U1
  Bottom 0.254: v22.08,20.16 22.08,24.22 21.57,24.73 21.57,26 21.83,26.25 21.83,72.99 21.07,73.75 A23.V1
1WDATA05L  (via drill 0.61)
  Top 0.254: v196.07,60.54 194.04,62.57 126.73,62.57 126.22,62.06 v2.52,62.06
  Route2 0.254: v196.07,60.54 212.08,44.54 215.63,44.54 216.9,43.27 B07.F2
  Bottom 0.254: v2.52,62.06 3.03,62.57 3.03,110.83 10.65,118.45 13.7,118.45 A23.D2
1WDATA06L  (via drill 0.61)
  Top 0.254: v49.01,111.85 48.5,111.34 32.5,111.34 29.96,113.88 19.29,113.88 18.02,115.15 A23.E2 | v71.36,52.92 73.9,50.38 163.31,50.38 172.96,40.73 204.71,40.73 210.3,35.14 216.14,35.14 216.9,35.9 B07.J2
  Bottom 0.254: v49.01,111.85 50.53,110.32 50.53,80.86 47.99,78.32 47.99,76.29 v71.36,52.92
1WDATA07L  (via drill 0.61)
  Top 0.254: v103.11,27.27 104.89,25.49 211.06,25.49 215.12,29.55 216.9,29.55 B07.L2
  Route2 0.254: v103.11,27.27 83.3,47.08 82.79,47.08 22.34,107.53 19.29,107.53 18.02,108.8 A23.H2
A06V1
  Top 0.254: A06.V1 235.95,75.02 233.92,77.05 A06.U2
  Route2 0.254: A06.L2 230.62,100.42 230.62,104.99 235.19,104.99 235.95,105.75 A06.J1
  Bottom 0.254: A06.N2 229.86,94.07 229.86,99.15 A06.L2 | A06.J1 236.21,105.5 235.44,104.74 235.44,100.67 235.19,100.42 235.19,75.78 235.95,75.02 A06.V1
A11U1
  Bottom 0.254: A11.U1 176.52,78.32 178.04,79.84 178.04,100.42 180.33,102.7 181.85,102.7 A10.K2 182.87,103.72 182.87,106.01 183.88,107.02 183.88,128.11 188.2,128.11 A10.A1
A13R1
  Bottom 0.254: A13.R1 148.07,87.72 149.08,88.73 149.08,94.83 150.35,96.1 A13.M1 150.1,97.12 150.1,99.4 148.58,100.93 148.58,101.69 146.29,103.97 146.29,109.56 138.92,116.93 138.92,117.69 134.61,117.69 133.84,116.93 133.84,116.42 139.43,110.83 139.43,108.04 140.7,106.77 A13.J2
AC00L
  Bottom 0.254: A05.K1 251.95,103.72 251.7,103.97 251.7,108.04 251.19,108.55 251.19,122.77 251.7,123.28 257.54,123.28 257.54,120.48 259.83,118.2 261.35,118.2 261.35,118.45 A04.D1 262.37,119.47 263.89,120.99 263.89,129.12 264.4,129.63 274.05,129.63 274.05,125.82 A03.B1 275.07,124.55 275.83,123.79 275.83,73.75 275.57,73.49 275.57,56.48 275.07,55.97 B03.B1
AC01L
  Top 0.254: A04.E1 265.67,116.17 267.19,117.69 273.29,117.69 274.05,118.45 A03.D1
  Route15 0.254: B03.D1 275.07,49.62 275.07,54.19 275.32,54.19 275.83,54.7 275.83,118.2 275.07,118.2 A03.D1
AC02L
  Route2 0.254: A04.K1 265.42,103.72 265.42,108.04 268.21,108.04 275.57,115.4 277.1,115.4 A03.E1
  Bottom 0.254: B03.E1 278.12,46.57 279.13,47.59 279.13,114.39 278.37,115.15 A03.E1
AC03L
  Route2 0.254: A04.L1 262.62,100.16 264.15,101.69 268.21,101.69 275.57,109.05 277.1,109.05 A03.H1
  Bottom 0.254: B03.H1 277.35,40.22 276.08,41.49 276.08,73.24 276.59,73.75 276.59,108.04 277.35,108.8 A03.H1
AC04L  (via drill 0.61)
  Top 0.254: A05.R1 249.92,86.7 250.68,85.94 257.54,85.94 258.81,87.21 261.35,87.21 A04.R1 | v263.89,38.19 272.78,38.19 274.05,36.92 B03.J1 | v262.37,104.23 272.53,104.23 274.05,105.75 A03.J1
  Bottom 0.254: v263.89,38.19 263.13,38.95 263.13,85.69 | 263.13,85.69 262.37,86.45 A04.R1 | v262.37,104.23 263.13,103.47 263.13,85.69
AC05L
  Top 0.254: A05.S1 252.97,84.42 253.73,85.18 259.83,85.18 260.59,84.42 264.4,84.42 A04.S1
  Route15 0.254: A04.S1 265.42,84.67 265.42,88.99 266.43,88.99 274.31,96.86 274.31,99.15 A03.L1
  Bottom 0.254: B03.L1 274.05,30.57 273.29,31.33 273.29,98.13 274.31,99.15 A03.L1
AC06L  (via drill 0.61)
  Top 0.254: A05.H2 246.62,109.82 250.94,109.82 251.7,110.58 257.29,110.58 258.05,109.82 A04.H2 | v271.26,95.08 271.51,95.34 276.08,95.34 277.1,96.35 A03.M1
  Route15 0.254: B03.M1 278.12,27.52 278.12,31.84 280.66,31.84 282.18,33.36 282.18,96.1 278.37,96.1 A03.M1 | v271.26,95.08 269.99,95.08 260.84,104.23 259.32,104.23 259.32,108.8 A04.H2
AC07L  (via drill 0.61)
  Top 0.254: v262.62,21.93 276.08,21.93 277.1,20.92 B03.P1 | A05.J2 243.57,105.75 244.33,104.99 254.24,104.99 255,105.75 A04.J2 | v260.08,91.53 276.34,91.53 277.1,90.77 A03.P1
  Bottom 0.254: v262.62,21.93 260.08,24.47 260.08,86.96 256.78,90.26 256.78,91.53 | 256.78,91.53 256.78,104.74 256.02,105.5 A04.J2 | 256.78,91.53 v260.08,91.53
AC08L  (via drill 0.61)
  Top 0.254: A05.N2 243.57,93.81 244.59,94.83 254.24,94.83 255,94.07 A04.N2 | v259.06,86.19 259.57,86.19 260.34,85.43 276.08,85.43 277.1,84.42 A03.S1
  Bottom 0.254: 256.78,86.19 256.78,89.5 256.02,90.26 256.02,92.8 A04.N2 | 256.78,86.19 256.78,77.56 258.81,75.53 258.81,3.39 268.97,3.39 275.83,10.25 275.83,12.03 277.35,13.55 B03.S1 | 256.78,86.19 v259.06,86.19
AC09L  (via drill 0.61)
  Top 0.254: v264.91,94.07 263.13,92.29 261.1,92.29 260.84,92.54 259.83,92.54 259.06,91.78 247.64,91.78 246.62,90.77 A05.P2
  Bottom 0.254: 266.43,95.59 266.94,96.1 266.94,117.18 267.96,118.2 A03.D2 | 266.43,95.59 v264.91,94.07 | 266.43,95.59 266.43,86.96 269.48,83.91 269.48,50.38 268.72,49.62 B03.D2
AC10L  (via drill 0.61)
  Route2 0.254: v246.87,100.16 247.89,101.18 254.49,101.18 267.19,113.88 269.23,113.88 270.75,115.4 A03.E2
  Route15 0.254: B03.E2 271,46.57 271,50.89 269.23,50.89 246.62,73.49 246.62,77.05 A05.U2
  Bottom 0.254: v246.87,100.16 247.38,99.66 247.38,79.34 246.37,78.32 A05.U2
AC11L  (via drill 0.61)
  Top 0.254: v243.32,39.97 270.75,39.97 B03.H2
  Bottom 0.254: v243.32,39.97 243.32,73.75 A05.V2 | A03.H2 272.02,108.8 272.78,108.04 272.78,41.24 271.76,40.22 B03.H2
B06V1
  Top 0.254: B06.V1 235.95,5.17 233.92,7.2 B06.U2
  Bottom 0.254: B06.L2 230.11,29.3 230.11,24.22 B06.N2 230.62,22.95 230.62,19.14 232.14,19.14 | 232.14,19.14 233.92,19.14 237.73,22.95 237.73,34.89 236.97,35.65 B06.J1 | 232.14,19.14 232.14,9.23 232.9,8.47 B06.U2
BAC00
  Top 0.254: B07.A1 227.57,58 228.84,56.73 298.69,56.73 299.45,55.97 B01.B1
  Bottom 0.254: B07.A1 226.55,59.27 225.79,60.03 225.79,127.09 226.55,127.85 A07.A1 | B01.B1 299.45,55.97 298.69,56.73 298.69,123.53 299.71,124.55 A01.B1
BAC01
  Top 0.254: B07.D1 224.52,49.37 225.54,50.38 290.31,50.38 292.85,47.84 298.69,47.84 299.45,48.6 B01.D1
  Route15 0.254: 295.13,120.23 298.69,120.23 299.45,119.47 A01.D1 | 295.13,120.23 225.54,120.23 224.52,119.21 A07.D1 | 295.13,120.23 295.13,45.55 296.15,44.54 299.71,44.54 299.71,48.35 B01.D1
BAC02
  Top 0.254: B01.E1 302.5,45.55 300.98,44.03 279.13,44.03 276.59,41.49 227.82,41.49 227.06,42.25 224.52,42.25 B07.F1
  Route15 0.254: A01.E1 302.75,115.15 302.75,110.58 302.5,110.58 301.99,110.07 301.99,46.57 302.75,46.57 B01.E1
  Bottom 0.254: B07.F1 223.25,43.27 222.49,44.03 222.49,110.83 223.51,111.85 A07.F1
BAC03
  Bottom 0.254: B01.H1 302.75,40.22 301.99,40.98 301.99,108.04 302.75,108.8 A01.H1
BAC04  (via drill 0.61)
  Top 0.254: B07.J1 224.52,35.9 225.79,34.63 290.05,34.63 293.1,37.68 298.69,37.68 299.45,36.92 B01.J1
  Route2 0.254: A07.J1 224.52,106.52 225.54,107.53 260.08,107.53 269.48,116.93 287.26,116.93 297.42,106.77 299.45,106.77 A01.J1
  Route15 0.254: v221.47,74.51 v223.51,76.54
  Bottom 0.254: v221.47,74.51 221.98,74 221.98,38.19 223.25,36.92 B07.J1 | v223.51,76.54 225.03,78.07 225.03,104.74 224.27,105.5 A07.J1
BAC05  (via drill 0.61)
  Top 0.254: B07.L1 224.27,29.3 224.27,25.49 256.02,25.49 256.53,26 270.24,26 270.75,25.49 298.18,25.49 301.74,29.05 301.74,34.38 296.15,34.38 295.64,33.87 295.64,30.57 299.45,30.57 B01.L1
  Route2 0.254: A07.L1 224.52,99.4 225.28,98.64 243.57,98.64 244.08,99.15 247.89,99.15 248.4,98.64 263.89,98.64 266.43,101.18 298.69,101.18 299.45,100.42 A01.L1 | v300.72,89.75 298.69,87.72 298.69,30.57 299.45,30.57 B01.L1
  Bottom 0.254: v300.72,89.75 301.23,90.26 301.23,98.39 300.47,99.15 A01.L1
BAC06  (via drill 0.61)
  Top 0.254: 244.33,24.98 300.98,24.98 302.5,26.51 B01.M1 | 244.33,24.98 225.54,24.98 224.52,23.96 B07.N1 | v244.33,24.47 244.33,24.98
  Route2 0.254: A07.N1 224.52,93.05 226.05,91.53 241.54,91.53 v243.83,89.24 250.43,82.64 268.21,82.64 280.91,95.34 301.48,95.34 302.5,96.35 A01.M1
  Bottom 0.254: v244.33,24.47 244.33,47.33 243.83,47.84 243.83,73.49 244.08,73.75 244.08,88.99 v243.83,89.24
BAC07  (via drill 0.61)
  Top 0.254: B07.R1 224.27,16.6 224.27,12.28 293.1,12.28 300.98,20.16 302.5,20.16 B01.P1 | v241.03,62.06 271.26,62.06 294.37,85.18 302.75,85.18 302.75,89.75 A01.P1
  Route2 0.254: A07.R1 224.27,86.45 224.27,82.13 225.79,82.13 241.03,66.89 v241.03,62.06 241.03,18.63 225.54,18.63 224.52,17.62 B07.R1
BAC08
  Top 0.254: B01.S1 302.5,13.81 300.98,12.28 296.91,12.28 287.51,2.88 225.79,2.88 224.52,4.15 B07.V1
  Route2 0.254: A01.S1 302.75,83.4 302.75,78.83 302.5,78.83 301.99,78.32 301.99,14.82 302.75,14.82 B01.S1
  Bottom 0.254: B07.V1 224.27,5.17 225.03,5.93 225.03,72.99 224.27,73.75 A07.V1
BAC09  (via drill 0.61)
  Top 0.254: B07.E2 220.97,46.57 220.97,50.89 291.83,50.89 293.1,49.62 B01.D2 | v221.22,120.23 221.73,120.74 291.83,120.74 293.1,119.47 A01.D2
  Bottom 0.254: v221.22,120.23 221.22,116.67 220.97,116.42 A07.E2 | B01.D2 294.12,49.62 294.88,50.38 294.88,117.44 294.12,118.2 A01.D2
BAC10  (via drill 0.61)
  Top 0.254: v296.66,41.74 295.9,40.98 243.06,40.98 240.27,38.19 221.98,38.19 221.22,38.95 B07.H2 | v222.24,118.71 222.24,120.23 290.31,120.23 294.37,116.17 296.15,116.17 A01.E2
  Route15 0.254: B01.E2 296.4,46.57 296.4,50.89 296.15,50.89 295.64,51.4 295.64,115.4 296.15,115.4 A01.E2
  Bottom 0.254: v296.66,41.74 296.66,45.3 B01.E2 | v222.24,118.71 222.24,111.34 220.97,110.07 A07.H2
BAC11  (via drill 0.61)
  Top 0.254: v219.95,60.29 v296.66,60.29
  Bottom 0.254: 219.44,60.29 219.44,87.21 221.98,89.75 221.98,101.69 221.22,102.45 A07.K2 | 219.44,60.29 219.44,34.63 220.2,33.87 B07.K2 | 298.18,60.29 298.18,108.04 297.42,108.8 A01.H2 | 298.18,60.29 298.18,41.24 297.17,40.22 B01.H2 | v219.95,60.29 219.44,60.29 | v296.66,60.29 298.18,60.29
BIOP1  (via drill 0.61)
  Top 0.254: v234.68,29.3 235.19,28.79 300.72,28.79 301.23,29.3 301.23,32.6 297.42,32.6 B01.K2
  Bottom 0.254: B06.P2 233.67,21.17 234.68,22.19 v234.68,29.3 234.68,88.99 233.92,89.75 A06.P2 | B01.K2 296.4,33.87 295.64,34.63 295.64,101.69 296.4,102.45 A01.K2
BIOP2  (via drill 0.61)
  Top 0.254: v229.09,28.28 295.13,28.28 296.15,27.27 B01.M2
  Route15 0.254: A01.M2 297.42,96.1 297.42,91.53 297.67,91.53 301.48,87.72 301.48,27.52 297.17,27.52 B01.M2
  Bottom 0.254: 228.84,28.28 228.84,82.64 229.86,83.65 229.86,86.45 A06.R2 | 228.84,28.28 228.84,18.63 229.6,17.87 B06.R2 | v229.09,28.28 228.84,28.28
BIOP4  (via drill 0.61)
  Top 0.254: B06.S2 233.67,14.82 233.67,18.63 294.62,18.63 296.15,20.16 B01.P2 | v237.48,69.18 271.26,69.18 279.38,77.3 280.66,77.3 281.67,76.29 284.72,76.29 294.62,86.19 296.4,86.19 296.4,89.75 A01.P2
  Route15 0.254: v236.21,83.15 234.17,83.15 233.92,83.4 A06.S2
  Bottom 0.254: v236.21,83.15 237.98,81.37 237.98,69.18 | 237.98,69.18 237.98,35.4 238.24,35.14 238.24,20.92 233.67,16.35 233.67,14.82 B06.S2 | 237.98,69.18 v237.48,69.18
BMB00H
  Bottom 0.254: B02.B1 287.77,55.97 288.28,56.48 288.28,73.49 288.53,73.75 288.53,123.79 287.77,124.55 A02.B1